# EAGLE design Testing FixtureForAICarBoard (EAGLE 9.6.2)
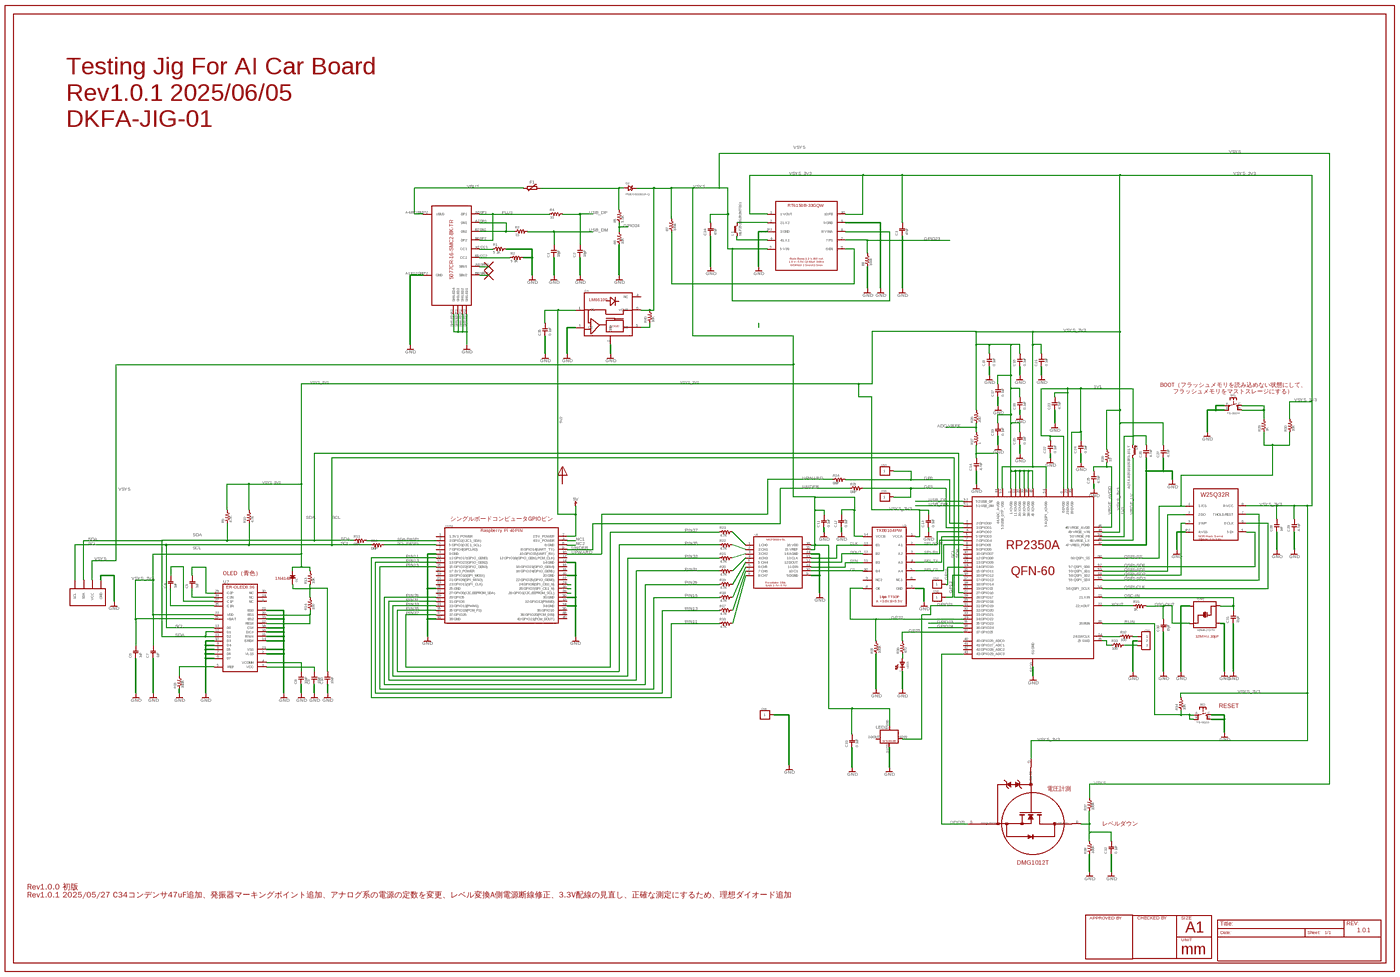
[diagram p0: schematic, sheet 1, overview]
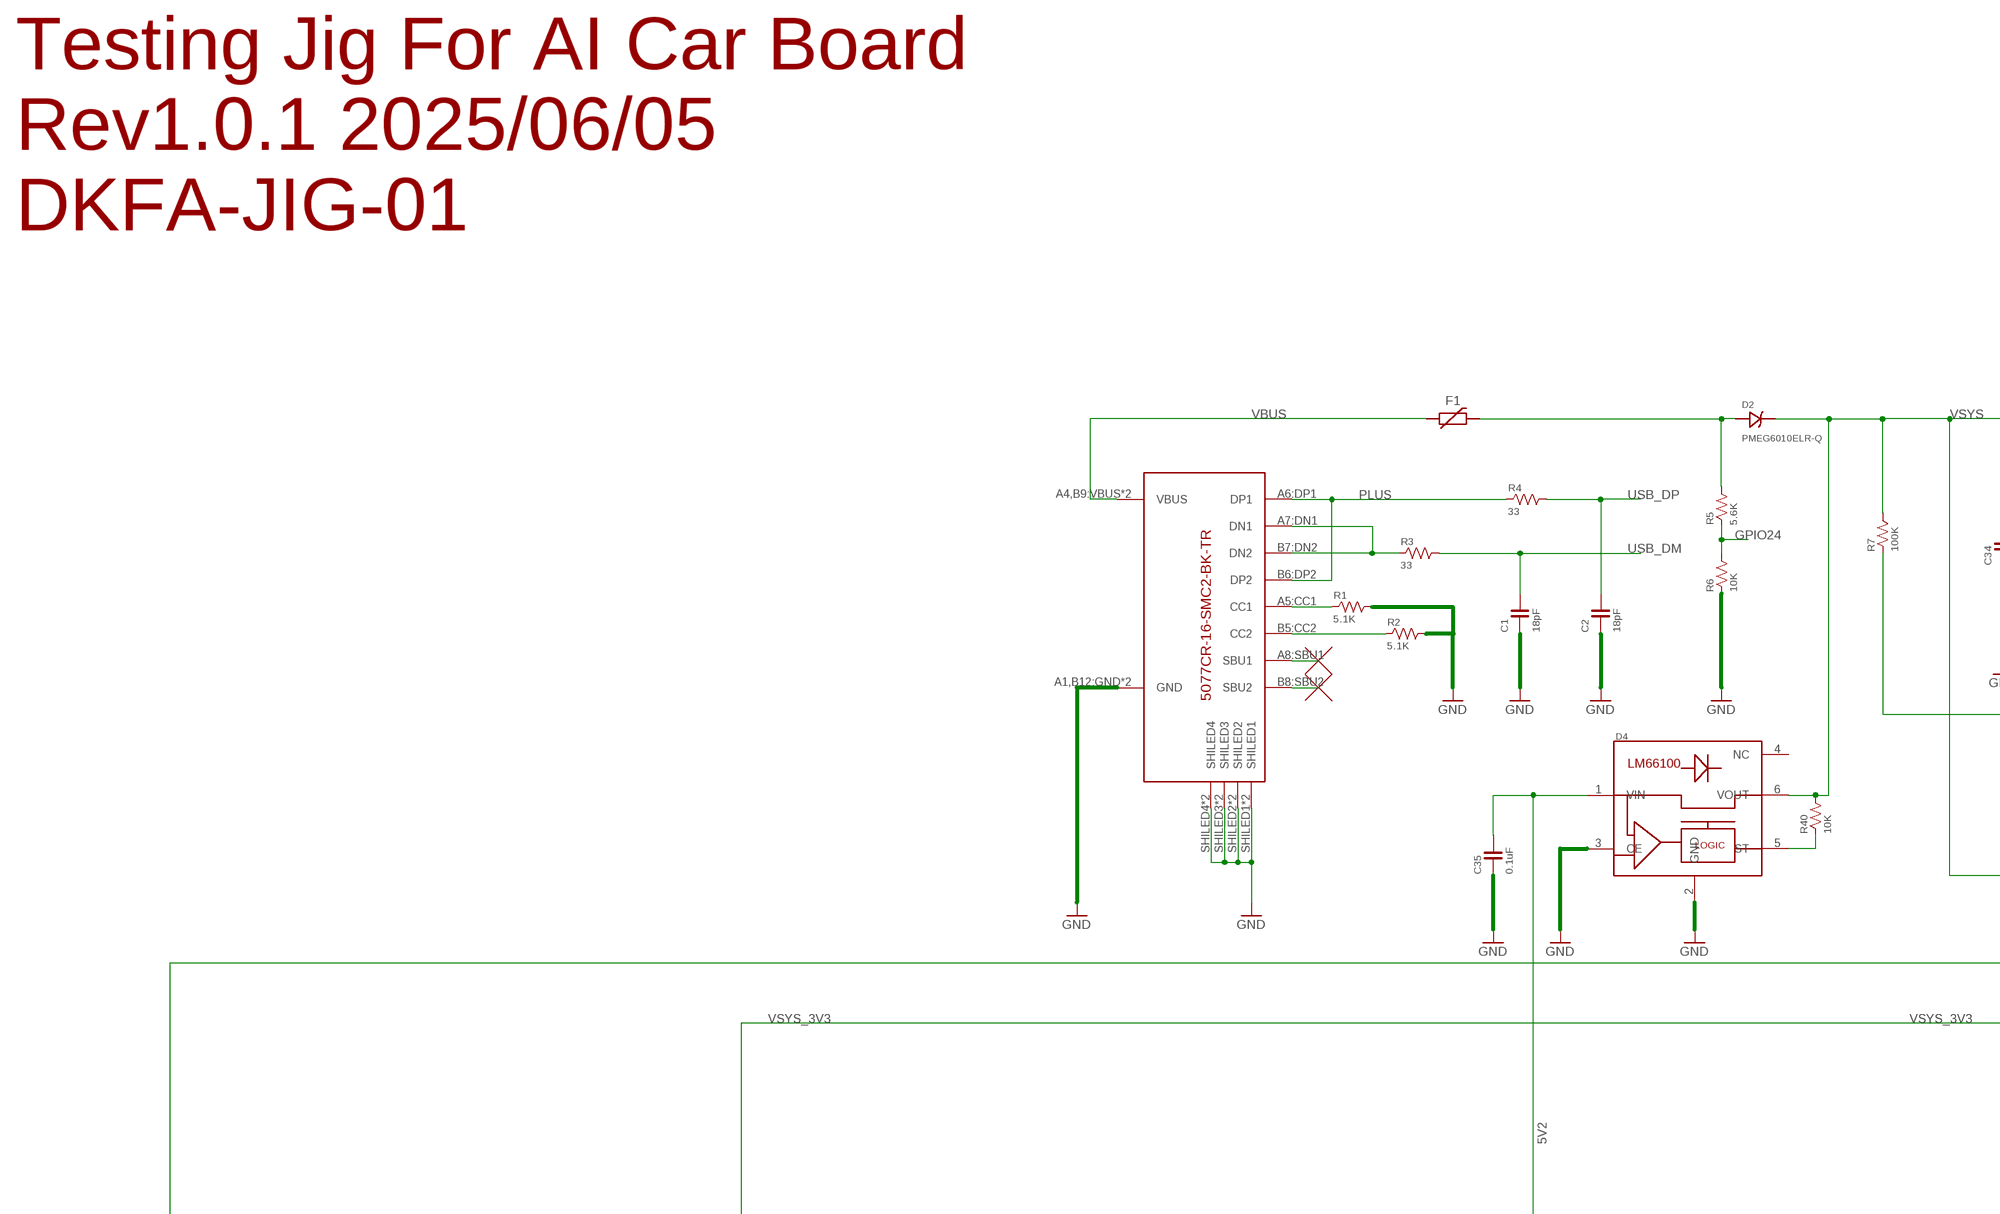
[diagram p1: schematic, sheet 1, part 1 of 4]
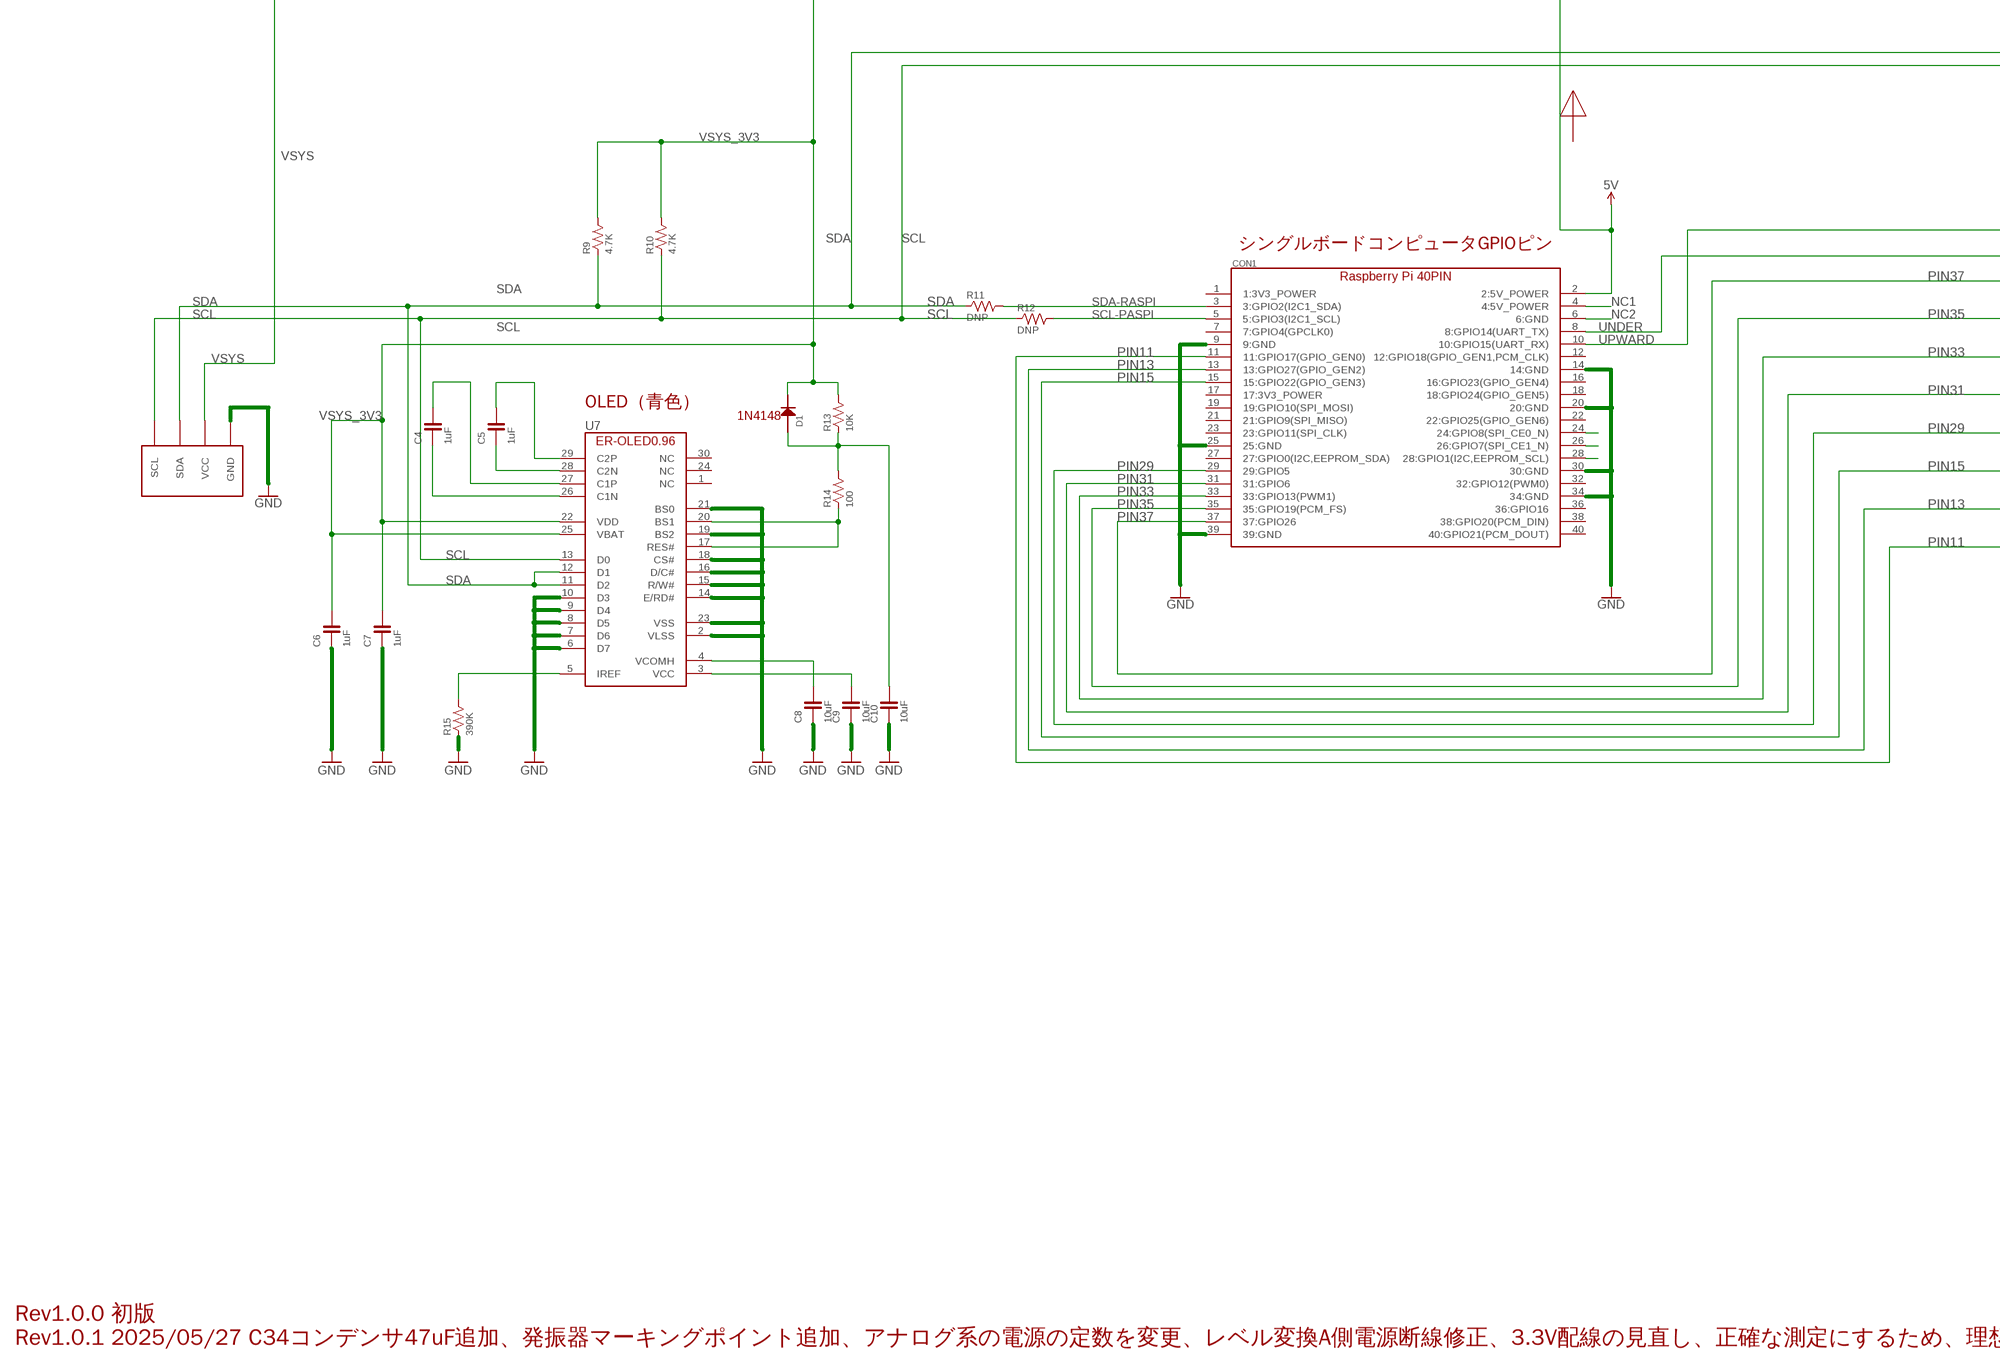
[diagram p2: schematic, sheet 1, part 2 of 4]
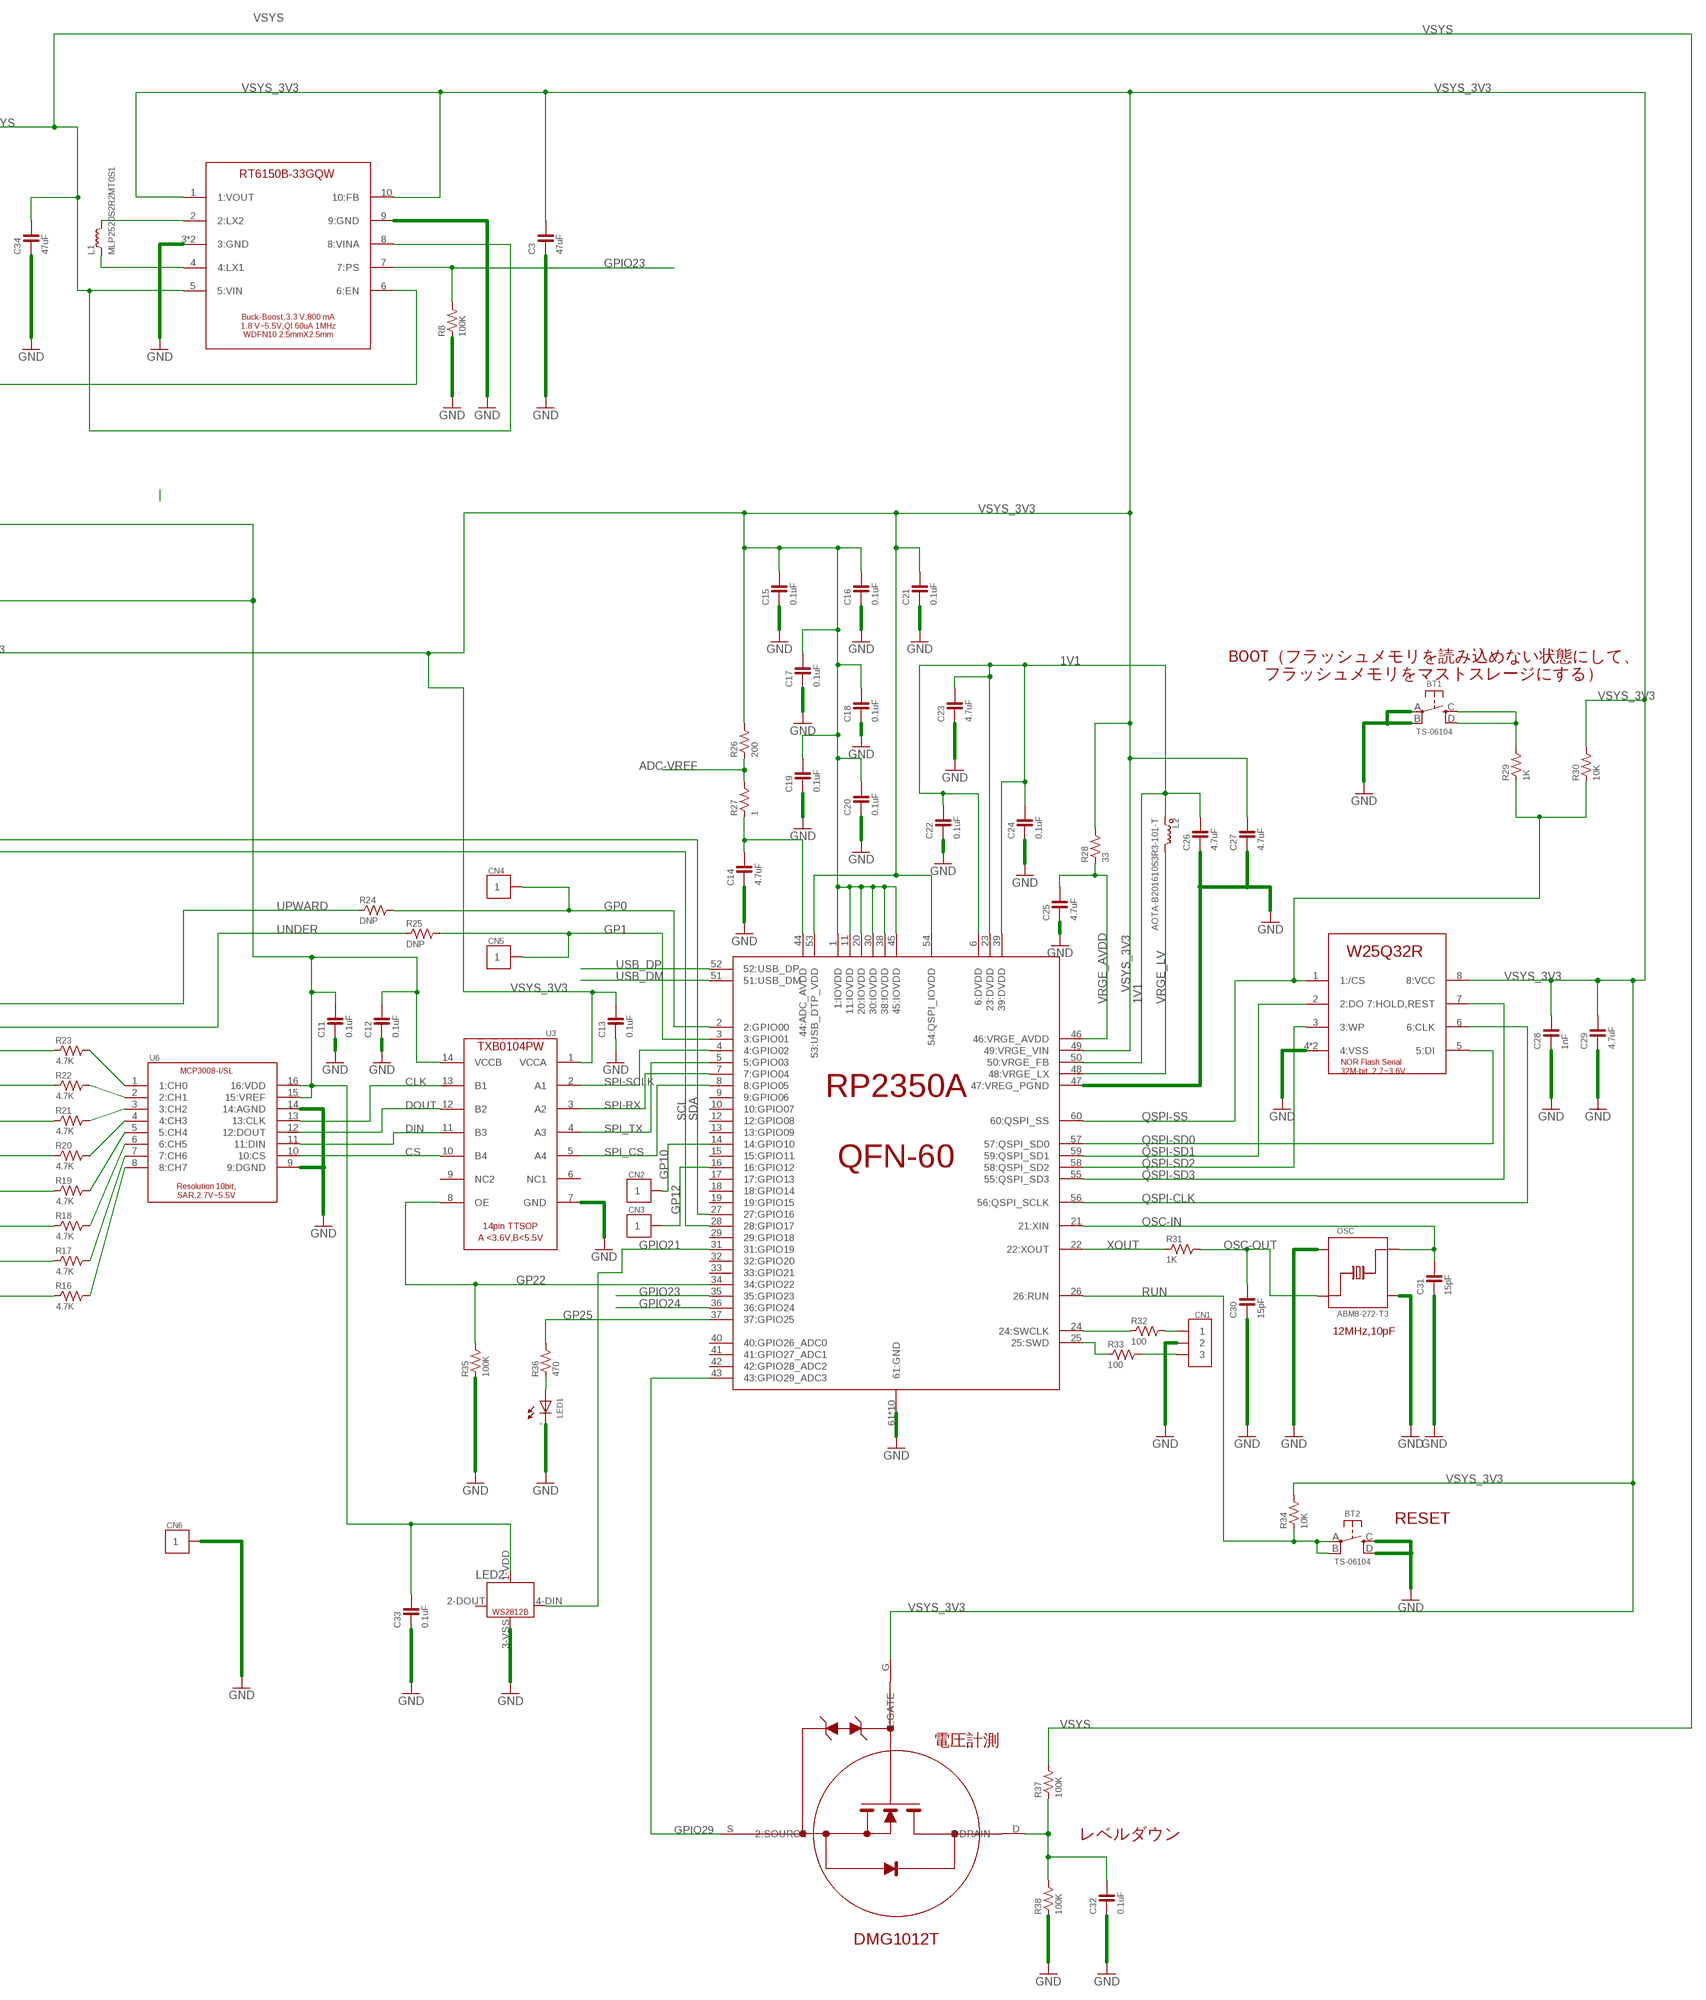
[diagram p3: schematic, sheet 1, part 3 of 4]
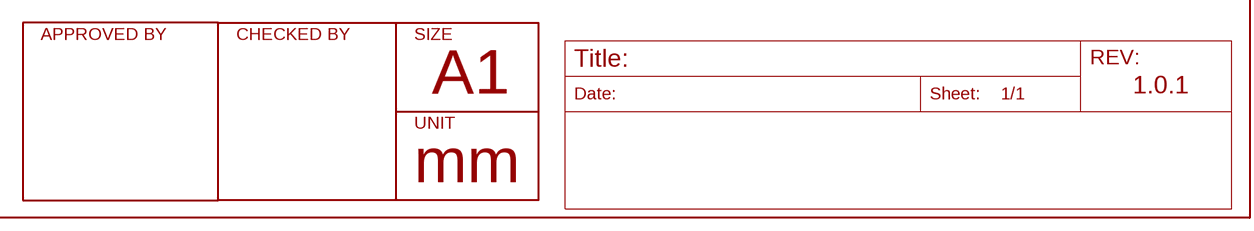
[diagram p4: schematic, sheet 1, part 4 of 4]

## Parts
BT1  TS-06104  [TS-06104]
BT2  TS-06104  [TS-06104]
C1  18pF  CAPACITOR-0603-BOTTOM  [0603-BOTTOM]
C2  18pF  CAPACITOR-0603-BOTTOM  [0603-BOTTOM]
C3  47uF  CAPACITOR-0603-BOTTOM  [0603-BOTTOM]
C4  1uF  CAPACITOR-0603-BOTTOM  [0603-BOTTOM]
C5  1uF  CAPACITOR-0603-BOTTOM  [0603-BOTTOM]
C6  1uF  CAPACITOR-0603-BOTTOM  [0603-BOTTOM]
C7  1uF  CAPACITOR-0603-BOTTOM  [0603-BOTTOM]
C8  10uF  CAPACITOR-0603-BOTTOM  [0603-BOTTOM]
C9  10uF  CAPACITOR-0603-BOTTOM  [0603-BOTTOM]
C10  10uF  CAPACITOR-0603-BOTTOM  [0603-BOTTOM]
C11  0.1uF  CAPACITOR-0603-BOTTOM  [0603-BOTTOM]
C12  0.1uF  CAPACITOR-0603-BOTTOM  [0603-BOTTOM]
C13  0.1uF  CAPACITOR-0603-BOTTOM  [0603-BOTTOM]
C14  4.7uF  CAPACITOR-0603-BOTTOM  [0603-BOTTOM]
C15  0.1uF  CAPACITOR-0603-BOTTOM  [0603-BOTTOM]
C16  0.1uF  CAPACITOR-0603-BOTTOM  [0603-BOTTOM]
C17  0.1uF  CAPACITOR-0603-BOTTOM  [0603-BOTTOM]
C18  0.1uF  CAPACITOR-0603-BOTTOM  [0603-BOTTOM]
C19  0.1uF  CAPACITOR-0603-BOTTOM  [0603-BOTTOM]
C20  0.1uF  CAPACITOR-0603-BOTTOM  [0603-BOTTOM]
C21  0.1uF  CAPACITOR-0603-BOTTOM  [0603-BOTTOM]
C22  0.1uF  CAPACITOR-0603-BOTTOM  [0603-BOTTOM]
C23  4.7uF  CAPACITOR-0603-BOTTOM  [0603-BOTTOM]
C24  0.1uF  CAPACITOR-0603-BOTTOM  [0603-BOTTOM]
C25  4.7uF  CAPACITOR-0603-BOTTOM  [0603-BOTTOM]
C26  4.7uF  CAPACITOR-0603-BOTTOM  [0603-BOTTOM]
C27  4.7uF  CAPACITOR-0603-BOTTOM  [0603-BOTTOM]
C28  1nF  CAPACITOR-0603-BOTTOM  [0603-BOTTOM]
C29  4.7uF  CAPACITOR-0603-BOTTOM  [0603-BOTTOM]
C30  15pF  CAPACITOR-0603-BOTTOM  [0603-BOTTOM]
C31  15pF  CAPACITOR-0603-BOTTOM  [0603-BOTTOM]
C32  0.1uF  CAPACITOR-0603-BOTTOM  [0603-BOTTOM]
C33  0.1uF  CAPACITOR-0603-BOTTOM  [0603-BOTTOM]
C34  47uF  CAPACITOR-0603-BOTTOM  [0603-BOTTOM]
C35  0.1uF  CAPACITOR-0603-BOTTOM  [0603-BOTTOM]
CN1  PIN_1X3  [PIN_1X3]
CN2  PIN_1X1-SMALL  [PIN_1X1_SMALL]
CN3  PIN_1X1-SMALL  [PIN_1X1_SMALL]
CN4  PIN_1X1-SMALL  [PIN_1X1_SMALL]
CN5  PIN_1X1-SMALL  [PIN_1X1_SMALL]
CN6  PIN_1X1-SMALL  [PIN_1X1_SMALL]
CON1  RASPBERRYPI_SHEILD  [RASPBERRY_PI_SHILED]
CON2  5077CR-16-SMC2-BK-TR  [5077CR-16-SMC2-BK-TR]
CON3  FABO_BRICK_I2C-S04B-PASK-2  [FABO_BRICK_I2C_S04B-PASK-2]
D1  1N4148  [1N4148W]
D2  PMEG6010ELR-Q  [SOD123W]
D4  LM66100  [SC-70]
F1  POLYSWITCH1206  [1206]
L1  MLP2520S2R2MT0S1  [1008(2520MM)]
L2  AOTA-B201610S3R3-101-T  [0806(2016MM)]
LED1  LED-0603  [0603]
LED2  WS2812B_NARROW  [WS2812B_NARROW]
OSC  ABM8-272-T3  [ABM8-272-T3]
R1  5.1K  RESISTOR-0603-BOTTOM  [0603-BOTTOM]
R2  5.1K  RESISTOR-0603-BOTTOM  [0603-BOTTOM]
R3  33  RESISTOR-0603-BOTTOM  [0603-BOTTOM]
R4  33  RESISTOR-0603-BOTTOM  [0603-BOTTOM]
R5  5.6K  RESISTOR-0603  [0603]
R6  10K  RESISTOR-0603  [0603]
R7  100K  RESISTOR-0603-BOTTOM  [0603-BOTTOM]
R8  100K  RESISTOR-0603-BOTTOM  [0603-BOTTOM]
R9  4.7K  RESISTOR-0603-BOTTOM  [0603-BOTTOM]
R10  4.7K  RESISTOR-0603-BOTTOM  [0603-BOTTOM]
R11  DNP  RESISTOR-0603-BOTTOM  [0603-BOTTOM]
R12  DNP  RESISTOR-0603-BOTTOM  [0603-BOTTOM]
R13  10K  RESISTOR-0603-BOTTOM  [0603-BOTTOM]
R14  100  RESISTOR-0603-BOTTOM  [0603-BOTTOM]
R15  390K  RESISTOR-0603-BOTTOM  [0603-BOTTOM]
R16  4.7K  RESISTOR-0603-BOTTOM  [0603-BOTTOM]
R17  4.7K  RESISTOR-0603-BOTTOM  [0603-BOTTOM]
R18  4.7K  RESISTOR-0603-BOTTOM  [0603-BOTTOM]
R19  4.7K  RESISTOR-0603-BOTTOM  [0603-BOTTOM]
R20  4.7K  RESISTOR-0603-BOTTOM  [0603-BOTTOM]
R21  4.7K  RESISTOR-0603-BOTTOM  [0603-BOTTOM]
R22  4.7K  RESISTOR-0603-BOTTOM  [0603-BOTTOM]
R23  4.7K  RESISTOR-0603-BOTTOM  [0603-BOTTOM]
R24  DNP  RESISTOR-0603-BOTTOM  [0603-BOTTOM]
R25  DNP  RESISTOR-0603-BOTTOM  [0603-BOTTOM]
R26  200  RESISTOR-0603-BOTTOM  [0603-BOTTOM]
R27  1  RESISTOR-0603-BOTTOM  [0603-BOTTOM]
R28  33  RESISTOR-0603-BOTTOM  [0603-BOTTOM]
R29  1K  RESISTOR-0603-BOTTOM  [0603-BOTTOM]
R30  10K  RESISTOR-0603-BOTTOM  [0603-BOTTOM]
R31  1K  RESISTOR-0603-BOTTOM  [0603-BOTTOM]
R32  100  RESISTOR-0603-BOTTOM  [0603-BOTTOM]
R33  100  RESISTOR-0603-BOTTOM  [0603-BOTTOM]
R34  10K  RESISTOR-0603-BOTTOM  [0603-BOTTOM]
R35  100K  RESISTOR-0603-BOTTOM  [0603-BOTTOM]
R36  470  RESISTOR-0603-BOTTOM  [0603-BOTTOM]
R37  100K  RESISTOR-0603  [0603]
R38  100K  RESISTOR-0603  [0603]
R40  10K  RESISTOR-0603  [0603]
U1  RP2350A  [QFN60]
U2  W25Q32RVXHJQ  [XSON8]
U3  TXB0104  [TSSOP-14]
U4  RT6150B-33GQW  [WDFN-10L_2.5X2.5MM]
U5  DMG1012T  [SOT-523]
U6  MCP3008  [SOIC-16]
U7  ER-OLED0.96-1ER-CON30HT-1_REV2  [ER-CON30HT-1_REV2]

## Nets
1V1: C22.2 C23.2 C24.2 C26.2 L2.2 U1.6(6:DVDD) U1.23(23:DVDD) U1.39(39:DVDD) U1.50(50:VRGE_FB)
5V2: C35.2 CON1.2(2:5V_POWER) D4.1(VIN) ; supply symbol labelled 5V
ADC-VREF: R26.1 R27.2
CLK: U3.13(B1) U6.13(13:CLK)
CS: U3.10(B4) U6.10(10:CS)
DATA: CN1.3 R33.2
DIN: U3.11(B3) U6.11(11:DIN)
DOUT: U3.12(B2) U6.12(12:DOUT)
GND: BT1.A BT1.B BT2.C BT2.D C1.1 C2.1 C3.1 C6.1 C7.1 C8.1 C9.1 C10.1 C11.1 C12.1 C13.1 C14.1 C15.1 C16.1 C17.1 C18.1 C19.1 C20.1 C21.1 C22.1 C23.1 C24.1 C25.1 C26.1 C27.1 C28.1 C29.1 C30.1 C31.1 C32.1 C33.1 C34.1 C35.1 CN1.2 CN6.1 CON1.9(9:GND) CON1.14(14:GND) CON1.20(20:GND) CON1.25(25:GND) CON1.30(30:GND) CON1.34(34:GND) CON1.39(39:GND) CON2.A1,B12:GND(GND) CON2.B1,A12:GND(GND) CON2.SHILED1 CON2.SHILED2 CON2.SHILED3 CON2.SHILED4 CON2.SHILED5(SHILED1) CON2.SHILED6(SHILED2) CON2.SHILED7(SHILED3) CON2.SHILED8(SHILED4) CON3.GND D4.2(GND) D4.3(CE) LED1.CATHODE LED2.3-VSS(VSS) OSC.2(#2) OSC.4(#4) R1.2 R2.2 R6.1 R8.1 R15.1 R35.1 R38.1 U1.47(47:VREG_PGND) U1.61(61:GND) U1.P$62(61:GND) U1.P$63(61:GND) U1.P$64(61:GND) U1.P$65(61:GND) U1.P$66(61:GND) U1.P$67(61:GND) U1.P$68(61:GND) U1.P$69(61:GND) U1.P$70(61:GND) U2.4(4:VSS) U2.9(4:VSS) U3.7(GND) U4.3(3:GND) U4.9(9:GND) U4.PAD(3:GND) U6.9(9:DGND) U6.14(14:AGND) U7.2(VLSS) U7.6(D7) U7.7(D6) U7.8(D5) U7.9(D4) U7.10(D3) U7.14(E/RD#) U7.15(R/W#) U7.16(D/C#) U7.18(CS#) U7.19(BS2) U7.21(BS0) U7.23(VSS)
GP0: CN4.1 R24.2 U1.2(2:GPIO00)
GP1: CN5.1 R25.2 U1.3(3:GPIO01)
GP10: CN2.1 U1.14(14:GPIO10)
GP12: CN3.1 U1.16(16:GPIO12)
GP22: R35.2 U1.34(34:GPIO22) U3.8(OE)
GP25: R36.2 U1.37(37:GPIO25)
GPIO21: LED2.4-DIN(DIN) U1.31(31:GPIO19)
GPIO23: R8.2 U1.35(35:GPIO23) U4.7(7:PS)
GPIO24: R5.1 R6.2 U1.36(36:GPIO24)
GPIO29: U1.43(43:GPIO29_ADC3) U5.S(2:SOURCE)
MINUS: CON2.A7:DN1(DN1) CON2.B7:DN2(DN2) R3.1
N$1: CON2.A5:CC1(CC1) R1.1
N$2: CON2.B5:CC2(CC2) R2.1
N$4: CON2.A8:SBU1(SBU1)
N$5: CON2.B8:SBU2(SBU2)
N$6: D4.5(ST) R40.1
N$7: C4.1 U7.26(C1N)
N$9: R23.2 U6.1(1:CH0)
N$10: L1.1 U4.4(4:LX1)
N$11: L1.2 U4.2(2:LX2)
N$12: R7.1 U4.6(6:EN)
N$13: R22.2 U6.2(2:CH1)
N$14: C4.2 U7.27(C1P)
N$16: R21.2 U6.3(3:CH2)
N$17: R20.2 U6.4(4:CH3)
N$18: R19.2 U6.5(5:CH4)
N$19: C5.1 U7.28(C2N)
N$20: R18.2 U6.6(6:CH5)
N$21: C5.2 U7.29(C2P)
N$22: R17.2 U6.7(7:CH6)
N$23: R15.2 U7.5(IREF)
N$24: C8.2 U7.4(VCOMH)
N$25: C9.2 U7.3(VCC)
N$26: R14.1 U7.17(RES#) U7.20(BS1)
N$27: C10.2 D1.ANODE R13.1 R14.2
N$28: R16.2 U6.8(8:CH7)
N$34: C14.2 R27.1 U1.44(44:ADC_AVDD)
N$39: C32.2 R37.1 R38.2 U5.D(3:DRAIN)
N$41: BT1.C BT1.D R29.2
N$44: LED1.ANODE R36.1
N$63: CON1.24(24:GPIO8(SPI_CE0_N))
N$65: CON1.26(26:GPIO7(SPI_CE1_N))
N$68: CON1.28(28:GPIO1(I2C,EEPROM_SCL))
NC1: CON1.4(4:5V_POWER)
NC2: CON1.6(6:GND)
OSC-IN: C31.2 OSC.3(#3) U1.21(21:XIN)
OSC-OUT: C30.2 OSC.1(#1) R31.2
PIN11: CON1.11(11:GPIO17(GPIO_GEN0)) R16.1
PIN13: CON1.13(13:GPIO27(GPIO_GEN2)) R17.1
PIN15: CON1.15(15:GPIO22(GPIO_GEN3)) R18.1
PIN29: CON1.29(29:GPIO5) R19.1
PIN31: CON1.31(31:GPIO6) R20.1
PIN33: CON1.33(33:GPIO13(PWM1)) R21.1
PIN35: CON1.35(35:GPIO19(PCM_FS)) R22.1
PIN37: CON1.37(37:GPIO26) R23.1
PLUS: CON2.A6:DP1(DP1) CON2.B6:DP2(DP2) R4.1
QSPI-CLK: U1.56(56:QSPI_SCLK) U2.6(6:CLK)
QSPI-SD0: U1.57(57:QSPI_SD0) U2.5(5:DI)
QSPI-SD1: U1.59(59:QSPI_SD1) U2.2(2:DO)
QSPI-SD2: U1.58(58:QSPI_SD2) U2.3(3:WP)
QSPI-SD3: U1.55(55:QSPI_SD3) U2.7(7:HOLD,REST)
QSPI-SS: R29.1 R30.1 U1.60(60:QSPI_SS) U2.1(1:/CS)
RUN: BT2.A BT2.B R34.1 U1.26(26:RUN)
SCL: CON3.SCL R10.1 R12.1 U1.28(28:GPIO17) U7.13(D0)
SCL-PASPI: CON1.5(5:GPIO3(I2C1_SCL)) R12.2
SDA: CON3.SDA R9.1 R11.1 U1.27(27:GPIO16) U7.11(D2) U7.12(D1)
SDA-RASPI: CON1.3(3:GPIO2(I2C1_SDA)) R11.2
SPI-RX: U1.7(7:GPIO04) U3.3(A2)
SPI-SCLK: U1.4(4:GPIO02) U3.2(A1)
SPI_CS: U1.8(8:GPIO05) U3.5(A4)
SPI_TX: U1.5(5:GPIO03) U3.4(A3)
SW_CLK: CN1.1 R32.2
SWCLK: R32.1 U1.24(24:SWCLK)
SWD: R33.1 U1.25(25:SWD)
UNDER: CON1.8(8:GPIO14(UART_TX)) R25.1
UPWARD: CON1.10(10:GPIO15(UART_RX)) R24.1
USB_DM: C1.2 R3.2 U1.51(51:USB_DM)
USB_DP: C2.2 R4.2 U1.52(52:USB_DP)
VBUS: CON2.A4,B9:VBUS(VBUS) CON2.B4,A9:VBUS(VBUS) F1.1
VBUS-2: D2.2(ANODE) F1.2 R5.2
VRGE_AVDD: C25.2 R28.1 U1.46(46:VRGE_AVDD)
VRGE_LV: L2.1 U1.48(48:VRGE_LX)
VSYS: C11.2 C12.2 C33.2 C34.2 CON3.VCC D2.1(CATHODE) D4.6(VOUT) LED2.1-VDD(VDD) R7.2 R37.2 R40.2 U3.14(VCCB) U4.5(5:VIN) U4.8(8:VINA) U6.15(15:VREF) U6.16(16:VDD)
VSYS_3V3: C3.2 C6.2 C7.2 C13.2 C15.2 C16.2 C17.2 C18.2 C19.2 C20.2 C21.2 C27.2 C28.2 C29.2 D1.CATHODE R9.2 R10.2 R13.2 R26.2 R28.2 R30.2 R34.2 U1.1(1:IOVDD) U1.11(11:IOVDD) U1.20(20:IOVDD) U1.30(30:IOVDD) U1.38(38:IOVDD) U1.45(45:IOVDD) U1.49(49:VRGE_VIN) U1.53(53:USB_DTP_VDD) U1.54(54:QSPI_IOVDD) U2.8(8:VCC) U3.1(VCCA) U4.1(1:VOUT) U4.10(10:FB) U5.G(1:GATE) U7.22(VDD) U7.25(VBAT)
XOUT: R31.1 U1.22(22:XOUT)
Unconnected: CON1.1(1:3V3_POWER) CON1.7(7:GPIO4(GPCLK0)) CON1.12(12:GPIO18(GPIO_GEN1,PCM_CLK)) CON1.16(16:GPIO23(GPIO_GEN4)) CON1.17(17:3V3_POWER) CON1.18(18:GPIO24(GPIO_GEN5)) CON1.19(19:GPIO10(SPI_MOSI)) CON1.21(21:GPIO9(SPI_MISO)) CON1.22(22:GPIO25(GPIO_GEN6)) CON1.23(23:GPIO11(SPI_CLK)) CON1.27(27:GPIO0(I2C,EEPROM_SDA)) CON1.32(32:GPIO12(PWM0)) CON1.36(36:GPIO16) CON1.38(38:GPIO20(PCM_DIN)) CON1.40(40:GPIO21(PCM_DOUT)) D4.4(NC) LED2.2-DOUT(DOUT) U1.9(9:GPIO06) U1.10(10:GPIO07) U1.12(12:GPIO08) U1.13(13:GPIO09) U1.15(15:GPIO11) U1.17(17:GPIO13) U1.18(18:GPIO14) U1.19(19:GPIO15) U1.29(29:GPIO18) U1.32(32:GPIO20) U1.33(33:GPIO21) U1.40(40:GPIO26_ADC0) U1.41(41:GPIO27_ADC1) U1.42(42:GPIO28_ADC2) U3.6(NC1) U3.9(NC2) U7.1(NC) U7.24(NC) U7.30(NC)

## Notes on the sheet
- Testing Jig For AI Car Board
  Rev1.0.1 2025/06/05
  DKFA-JIG-01
- LM66100
- BOOT（フラッシュメモリを読み込めない状態にして、
  フラッシュメモリをマストスレージにする）
- シングルボードコンピュータGPIOピン
- OLED（青色）
- 1N4148
- 12MHz,10pF
- RESET
- 電圧計測
- レベルダウン
- DMG1012T
- Rev1.0.0 初版
  Rev1.0.1 2025/05/27 C34コンデンサ47uF追加、発振器マーキングポイント追加、アナログ系の電源の定数を変更、レベル変換A側電源断線修正、3.3V配線の見直し、正確な測定にするため、理想ダイオード追加
- 1.0.1

## Library data of the parts
BT1 BT2 = FaBo-Switch:TS-06104
C1-C3 C11-C35 = FaBo-Capacitor:CAPACITOR: CAPACITOR; SPICEPREFIX: C
C4-C10 = FaBo-Capacitor:CAPACITOR: CAPACITOR
CN1 = FaBo-PIN:PIN_1X3
CN2-CN6 = FaBo-PIN:PIN_1X1
CON1 = FaBo-Boards:RASPBERRYPI_SHEILD
CON2 = FaBo-USB:5077CR-16-SMC2-BK-TR; SPICEPREFIX: X
CON3 = FaBo-Template:FABO_BRICK_I2C: FaBo Brick I2C
D1 = FaBo-Diode:1N4148
D2 = FaBo-Diode:PMEG6010ELR-Q
D4 = FaBo-Diode:LM66100
F1 = FaBo-Supply:POLYSWITCH
L1 = FaBo-Coil:MLP2520S2R2MT0S1
L2 = FaBo-Coil:AOTA-B201610S3R3-101-T
LED1 = FaBo-LED:LED
LED2 = FaBo-LED:WS2812B_NARROW
OSC = FaBo-Crystal:ABM8-272-T3
R1-R4 R7 R8 R11 R12 R16-R30 R34-R36 = FaBo-Resistors:RESISTOR: RESISTOR; SPICEPREFIX: R
R5 R6 R9 R10 R13-R15 R31-R33 R37 R38 R40 = FaBo-Resistors:RESISTOR: RESISTOR
U1 = FaBo-MPU:RP2350A
U2 = FaBo-NORFLASH:W25Q32RVXHJQ
U3 = FaBo-LevelTranslator:TXB0104
U4 = FaBo-Supply:RT6150B-33GQW
U5 = FaBo-Mosfet:DMG1012T
U6 = FaBo-ADC:MCP3008
U7 = FaBo-Display:ER-OLED0.96-1: ER-CON30HT-1 Rev2 wide distance 0.23mm

## Board
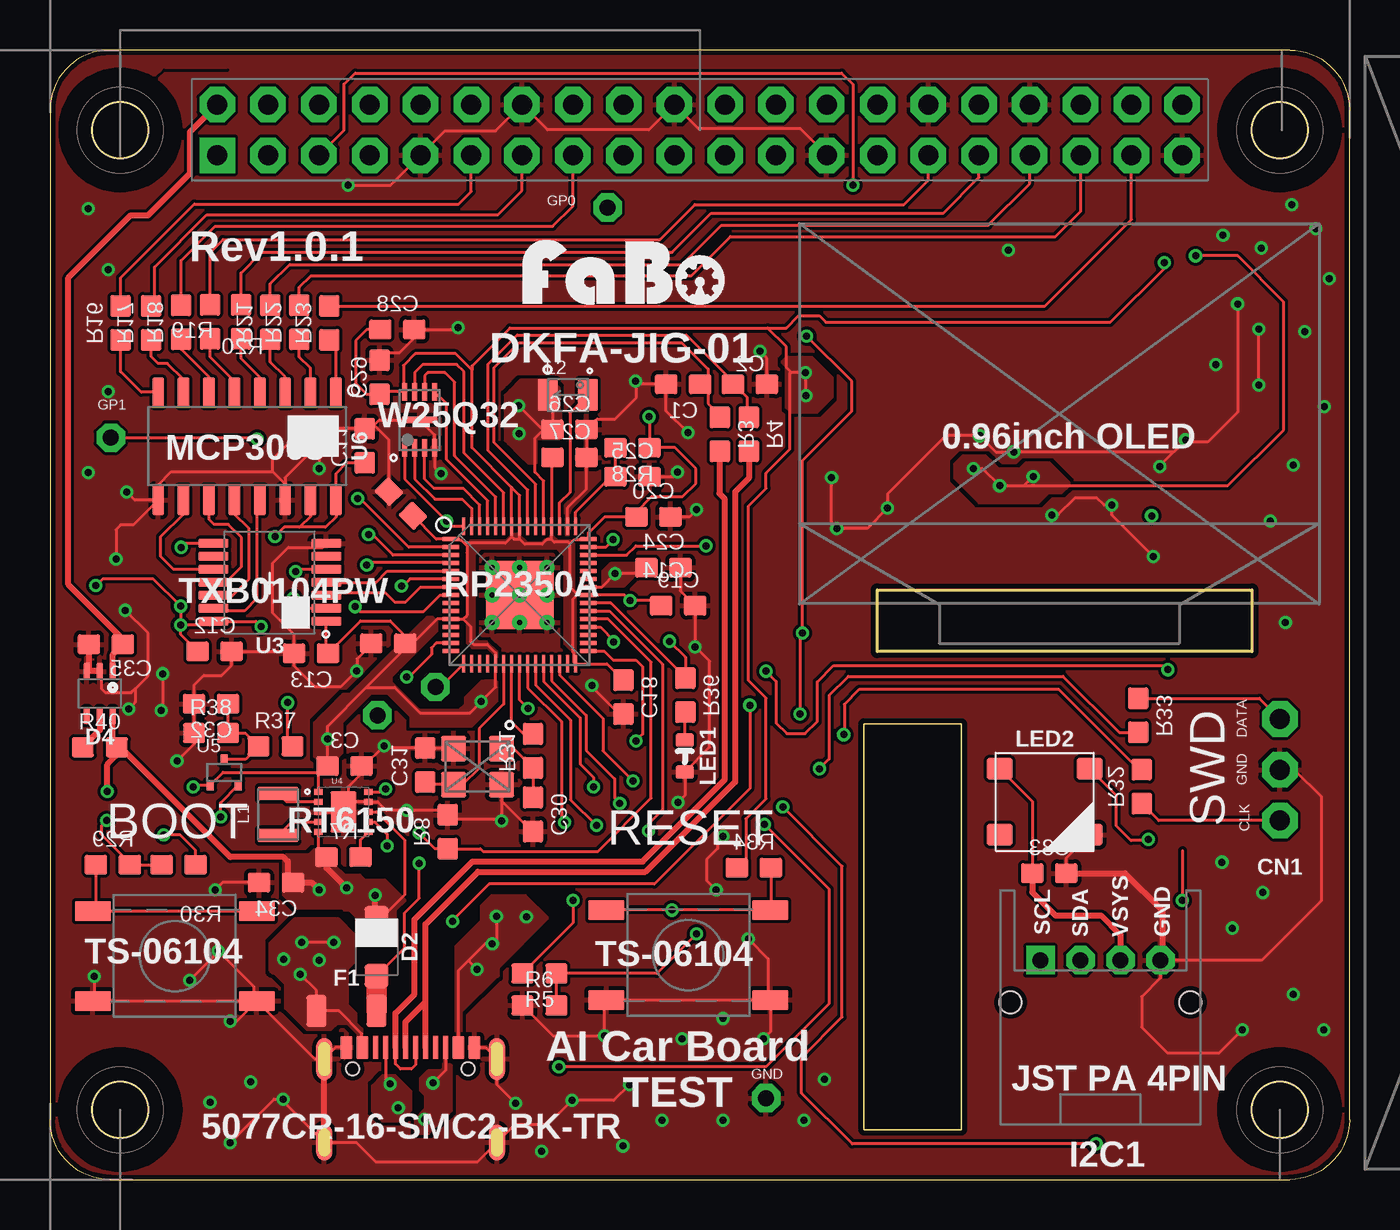
[diagram p5: board, top side]
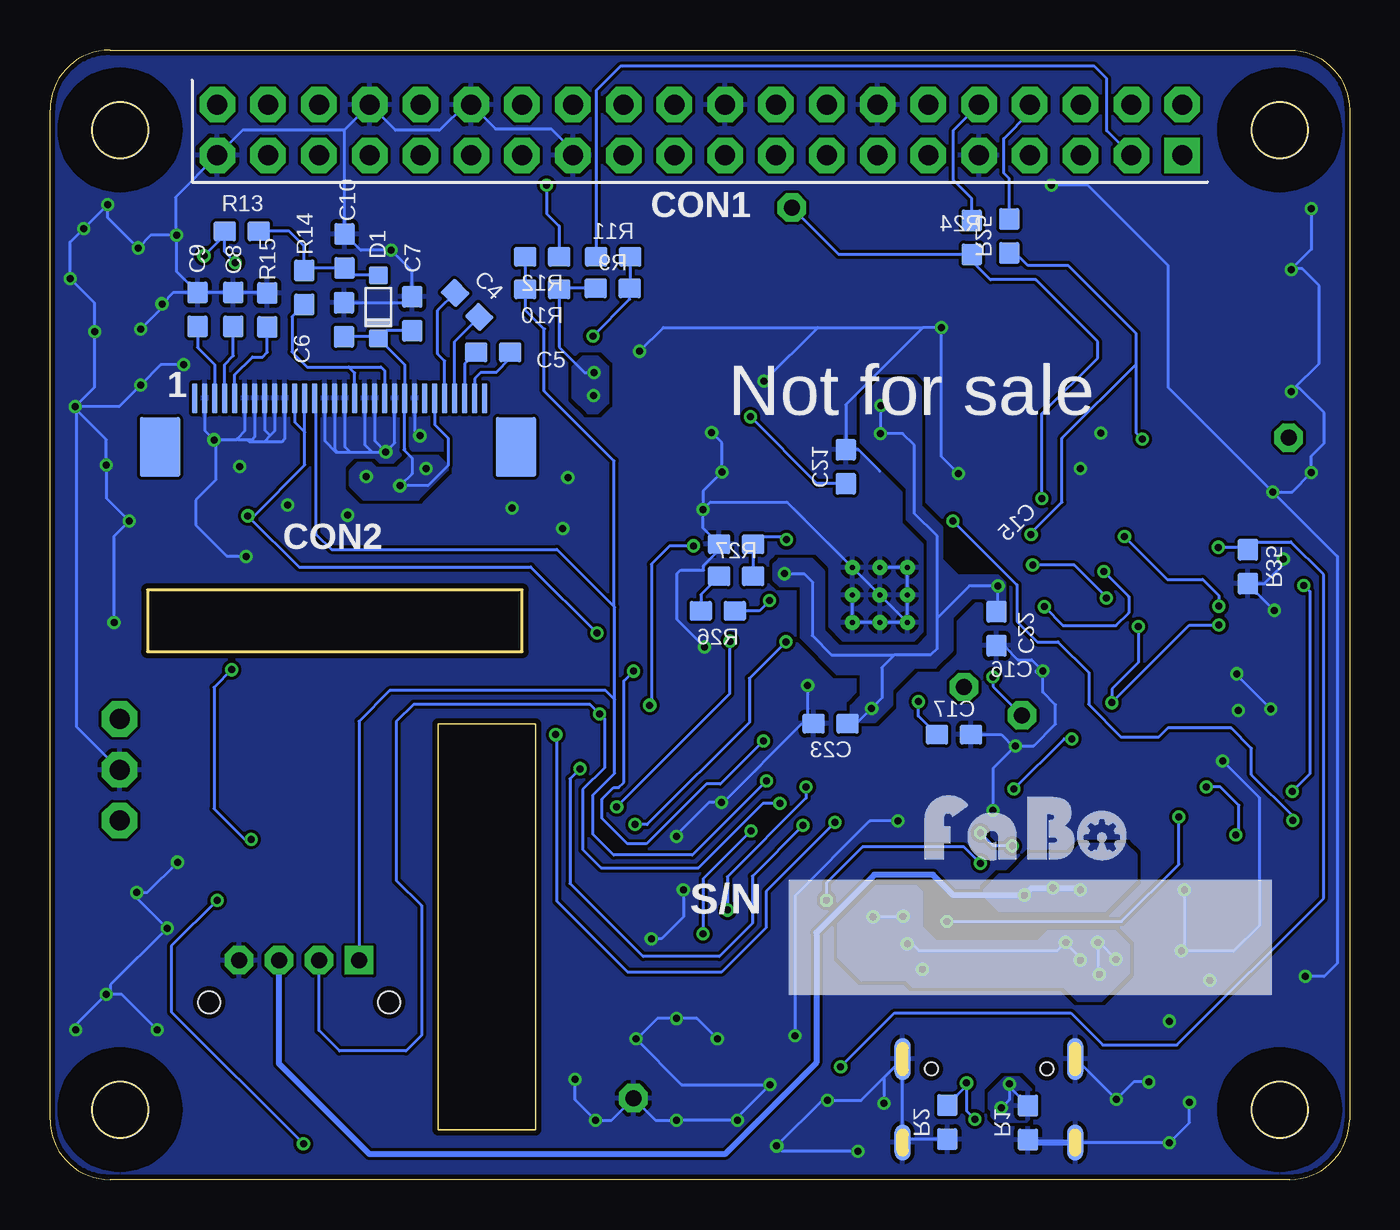
[diagram p6: board, bottom side, seen from below]

Size 65 x 56.5 mm. Coordinates in mm from the lower left corner, seen from the top.
Outline: 41.38,29.5 60.12,29.5 60.12,26.41 41.38,26.41 41.38,29.5
Outline: 40.71,22.8 45.59,22.8 45.59,2.5 40.71,2.5 40.71,22.8
Copper layers (1*16): Top 0.035mm / dielectric 1.6mm / Bottom 0.035mm
Design rules "PCBway": minimum track width 6mil, minimum drill 12mil, track to track 6mil, track to pad 6mil, pad to pad 6mil, via to via 6mil, smd to smd 6mil, copper to edge 10mil, drill to drill 10mil, minimum pad ring 10mil, minimum via ring 6mil, stop-mask expansion 2mil, vias tented up to drill 100mil, thermal gap 8mil
Holes 2.8 mm at 3.5,52.5 61.5,52.5 3.5,3.5 61.5,3.5
tRestrict: area 0.5,49.4 to 6.6,55.6; area 58.4,49.4 to 64.6,55.6; area 0.4,0.4 to 6.6,6.6; area 58.4,0.4 to 64.6,6.6; 2 lines
bRestrict: area 0.4,49.4 to 6.6,55.6; area 58.4,49.4 to 64.6,55.6; area 0.4,0.4 to 6.6,6.6; area 58.4,0.4 to 64.6,6.6; 8 lines

### Footprints (pad centres in the part's own frame; a part is rotated, then mirrored left to right if it is on the bottom)
TS-06104 = smd 1.8 x 1: A 4.1,2.25; B -4.1,2.25; C 4.1,-2.25; D -4.1,-2.25
0603-BOTTOM = smd 1.1 x 1 bottom: 1 -0.85,0; 2 0.85,0
PIN_1X3 = drill 1 pad 1.778 octagon: 1 -2.54,0; 2 0,0; 3 2.54,0
PIN_1X1_SMALL = drill 0.8 pad 1.422 octagon: 1 0,0
RASPBERRY_PI_SHILED = drill 1 pad 1.778 square: 1 -24.13,-1.27 | drill 1 pad 1.778 octagon: 2 -24.13,1.27; 3 -21.59,-1.27; 4 -21.59,1.27; 5 -19.05,-1.27; 6 -19.05,1.27; 7 -16.51,-1.27; 8 -16.51,1.27; 9 -13.97,-1.27; 10 -13.97,1.27; 11 -11.43,-1.27; 12 -11.43,1.27; 13 -8.89,-1.27; 14 -8.89,1.27; 15 -6.35,-1.27; 16 -6.35,1.27; 17 -3.81,-1.27; 18 -3.81,1.27; 19 -1.27,-1.27; 20 -1.27,1.27; 21 1.27,-1.27; 22 1.27,1.27; 23 3.81,-1.27; 24 3.81,1.27; 25 6.35,-1.27; 26 6.35,1.27; 27 8.89,-1.27; 28 8.89,1.27; 29 11.43,-1.27; 30 11.43,1.27; 31 13.97,-1.27; 32 13.97,1.27; 33 16.51,-1.27; 34 16.51,1.27; 35 19.05,-1.27; 36 19.05,1.27; 37 21.59,-1.27; 38 21.59,1.27; 39 24.13,-1.27; 40 24.13,1.27
5077CR-16-SMC2-BK-TR = smd 0.6 x 1.14: A1,B12:GND -3.2,0; A4,B9:VBUS -2.4,0; B1,A12:GND 3.2,0; B4,A9:VBUS 2.4,0 | smd 0.3 x 1.14: A5:CC1 -1.25,0; A6:DP1 -0.25,0; A7:DN1 0.25,0; A8:SBU1 1.25,0; B5:CC2 1.75,0; B6:DP2 0.75,0; B7:DN2 -0.75,0; B8:SBU2 -1.75,0 | smd 0.8 x 2.1: SHILED1 -4.32,-0.57; SHILED2 4.32,-0.57 | smd 0.8 x 1.8: SHILED3 -4.32,-4.75; SHILED4 4.32,-4.75 | smd 0.8 x 2.1 bottom: SHILED5 -4.32,-0.57; SHILED7 4.32,-0.57 | smd 0.8 x 1.8 bottom: SHILED6 -4.32,-4.75; SHILED8 4.32,-4.75 | hole 0.65: -2.89,-1.07; 2.89,-1.07
FABO_BRICK_I2C_S04B-PASK-2 = drill 0.8 pad 1.422 octagon: GND -3,0; SDA 1,0; VCC -1,0 | drill 0.8 pad 1.422 square: SCL 3,0 | hole 1.1: 4.5,2.1; -4.5,2.1
1N4148W = smd 0.9 x 0.95: ANODE 0,0; CATHODE 3.15,0
SOD123W = smd 1.2 x 1.2: 1 -1.45,0; 2 1.45,0
SC-70 = smd 0.35 x 0.85: 1 -0.65,-1.1; 2 0,-1.1; 3 0.65,-1.1; 4 0.65,1.1; 5 0,1.1; 6 -0.65,1.1
1206 = smd 1 x 1.6: 1 -1.5,0; 2 1.5,0
1008(2520MM) = smd 0.7 x 2: 1 -1.05,0; 2 1.05,0
0806(2016MM) = smd 1 x 1.6: 1 1,0; 2 -1,0
0603 = smd 0.65 x 0.9: ANODE -0.8,0; CATHODE 0.8,0
WS2812B_NARROW = smd 1.3 x 1.1: 1-VDD -2.25,1.65; 2-DOUT -2.25,-1.65; 3-VSS 2.25,-1.65; 4-DIN 2.25,1.65
ABM8-272-T3 = smd 1.27 x 1.27: 1 -1.2,-0.9; 2 1.2,-0.9; 3 1.2,0.9; 4 -1.2,0.9
0603' = smd 1.1 x 1: 1 -0.85,0; 2 0.85,0
QFN60 = smd 0.875 x 0.2: 1 -3.438,2.8; 2 -3.438,2.4; 3 -3.438,2; 4 -3.438,1.6; 5 -3.438,1.2; 6 -3.438,0.8; 7 -3.438,0.4; 8 -3.438,0; 9 -3.438,-0.4; 10 -3.438,-0.8; 11 -3.438,-1.2; 12 -3.438,-1.6; 13 -3.438,-2; 14 -3.438,-2.4; 15 -3.438,-2.8; 31 3.438,-2.8; 32 3.438,-2.4; 33 3.438,-2; 34 3.438,-1.6; 35 3.438,-1.2; 36 3.438,-0.8; 37 3.438,-0.4; 38 3.438,0; 39 3.438,0.4; 40 3.438,0.8; 41 3.438,1.2; 42 3.438,1.6; 43 3.438,2; 44 3.438,2.4; 45 3.438,2.8 | smd 0.2 x 0.875: 16 -2.8,-3.438; 17 -2.4,-3.438; 18 -2,-3.438; 19 -1.6,-3.438; 20 -1.2,-3.438; 21 -0.8,-3.438; 22 -0.4,-3.438; 23 0,-3.438; 24 0.4,-3.438; 25 0.8,-3.438; 26 1.2,-3.438; 27 1.6,-3.438; 28 2,-3.438; 29 2.4,-3.438; 30 2.8,-3.438; 46 2.8,3.438; 47 2.4,3.438; 48 2,3.438; 49 1.6,3.438; 50 1.2,3.438; 51 0.8,3.438; 52 0.4,3.438; 53 0,3.438; 54 -0.4,3.438; 55 -0.8,3.438; 56 -1.2,3.438; 57 -1.6,3.438; 58 -2,3.438; 59 -2.4,3.438; 60 -2.8,3.438 | smd 3.4 x 3.4: 61 0,0 | drill 0.25 pad 0.61: P$62 0,0; P$63 -1.375,0; P$64 0,-1.375; P$65 -1.375,-1.375; P$66 1.375,-1.375; P$67 1.375,0; P$68 -1.375,1.375; P$69 0,1.375; P$70 1.375,1.375
XSON8 = smd 0.85 x 0.3: 1 -1.4,0.75; 2 -1.4,0.25; 3 -1.4,-0.25; 4 -1.4,-0.75; 5 1.4,-0.75; 6 1.4,-0.25; 7 1.4,0.25; 8 1.4,0.75 | smd 0.3 x 1.78: 9 0,0
TSSOP-14 = smd 0.45 x 1.5: 1 -1.95,-2.825; 2 -1.3,-2.825; 3 -0.65,-2.825; 4 0,-2.825; 5 0.65,-2.825; 6 1.3,-2.825; 7 1.95,-2.825; 8 1.95,2.825; 9 1.3,2.825; 10 0.65,2.825; 11 0,2.825; 12 -0.65,2.825; 13 -1.3,2.825; 14 -1.95,2.825
WDFN-10L_2.5X2.5MM = smd 0.3 x 0.45: 1 -1,-1.25; 2 -0.5,-1.25; 3 0,-1.25; 4 0.5,-1.25; 5 1,-1.25; 6 1,1.25; 7 0.5,1.25; 8 0,1.25; 9 -0.5,1.25; 10 -1,1.25 | smd 2.07 x 1.3: PAD 0,0
SOT-523 = smd 0.4 x 0.51: D 0,0.645; G -0.7,-0.645; S 0.7,-0.645
SOIC-16 = smd 0.6 x 1.5: 1 -4.445,-2.7; 2 -3.175,-2.7; 3 -1.905,-2.7; 4 -0.635,-2.7; 5 0.635,-2.7; 6 1.905,-2.7; 7 3.175,-2.7; 8 4.445,-2.7; 9 4.445,2.7; 10 3.175,2.7; 11 1.905,2.7; 12 0.635,2.7; 13 -0.635,2.7; 14 -1.905,2.7; 15 -3.175,2.7; 16 -4.445,2.7
ER-CON30HT-1_REV2 = smd 0.27 x 1.5 bottom: 1 7,-0.23; 2 6.5,-0.23; 3 6,-0.23; 4 5.5,-0.23; 5 5,-0.23; 6 4.5,-0.23; 7 4,-0.23; 8 3.5,-0.23; 9 3,-0.23; 10 2.5,-0.23; 11 2,-0.23; 12 1.5,-0.23; 13 1,-0.23; 14 0.5,-0.23; 15 0,-0.23; 16 -0.5,-0.23; 17 -1,-0.23; 18 -1.5,-0.23; 19 -2,-0.23; 20 -2.5,-0.23; 21 -3,-0.23; 22 -3.5,-0.23; 23 -4,-0.23; 24 -4.5,-0.23; 25 -5,-0.23; 26 -5.5,-0.23; 27 -6,-0.23; 28 -6.5,-0.23; 29 -7,-0.23; 30 -7.5,-0.23 | smd 2 x 3 bottom: 31 -9.07,-2.67; 32 8.74,-2.67

### Placement (x,y rotation side)
BT1  6.25,11.18 180 top
BT2  31.93,11.23 0 top
C1  31.67,39.78 180 bottom
C2  35,39.78 0 bottom
C3  14.73,20.68 0 bottom
C4  44.14,43.75 225 top
C5  42.83,41.38 180 top
C6  50.29,43.01 270 top
C7  46.88,43.31 270 top
C8  55.83,43.52 270 top
C9  57.62,43.52 270 top
C10  50.27,46.44 270 top
C11  15.75,36.7 270 bottom
C12  8.23,26.42 0 bottom
C13  13.06,26.31 180 bottom
C14  30.68,31.78 180 top
C15  17.55,33.81 225 bottom
C16  16.92,26.82 180 bottom
C17  19.79,22.25 0 top
C18  28.68,24.13 90 bottom
C19  31.42,28.7 0 bottom
C20  30.18,33.15 0 bottom
C21  25.2,35.66 270 top
C22  17.65,27.56 90 top
C23  25.96,22.81 180 top
C24  30.68,30.61 0 bottom
C25  29.13,35.15 0 bottom
C26  25.98,37.52 0 bottom
C27  25.98,36.12 0 bottom
C28  17.37,42.52 0 bottom
C29  16.48,40.13 270 bottom
C30  24.16,18.26 90 bottom
C31  18.77,20.73 270 bottom
C32  8.05,23.8 180 bottom
C33  49.99,15.32 0 bottom
C34  11.3,14.86 180 bottom
C35  2.79,26.77 180 bottom
CN1  61.52,20.5 90 top
CN2  16.38,23.22 0 top
CN3  19.28,24.64 0 top
CN4  27.89,48.62 0 top
CN5  3.05,37.11 0 top
CN6  35.81,4.06 0 top
CON1  32.5,52.5 0 top
CON2  18.03,6.6 0 top
CON3  52.55,10.97 180 top
D1  48.58,45.23 270 bottom
D2  16.33,11.63 270 top
D4  2.49,24.31 180 top
F1  14.83,8.43 0 top
L1  11.4,18.26 90 top
L2  25.91,39.24 0 top
LED1  31.75,21.18 270 top
LED2  49.76,18.9 0 top
LOGO1  [LOGO_FABO_M]  28.69,43.38 0 top
LOGO2  [LOGO_FABO_M]  16.2,15.59 0 bottom
OSC  21.39,20.65 180 top
R1  16.08,2.84 270 top
R2  20.12,2.87 270 top
R3  33.5,37.29 90 bottom
R4  34.95,37.29 90 bottom
R5  5.6K  [0603']  24.49,10.31 180 top
R6  10K  [0603']  24.49,8.71 0 top
R7  14.68,16.13 0 bottom
R8  19.89,17.4 270 bottom
R9  36.86,44.58 0 top
R10  40.39,44.53 180 top
R11  36.83,46.15 0 top
R12  40.39,46.15 180 top
R13  55.41,47.43 0 top
R14  52.29,44.62 90 top
R15  54.13,43.49 270 top
R16  3.53,42.85 270 bottom
R17  5.05,42.85 270 bottom
R18  6.55,42.88 270 bottom
R19  8,42.9 270 bottom
R20  9.55,42.9 270 bottom
R21  11.02,42.88 270 bottom
R22  12.47,42.88 270 bottom
R23  13.97,42.85 270 bottom
R24  18.9,47.12 270 top
R25  17.02,47.19 270 top
R26  31.6,28.45 180 top
R27  30.68,30.18 0 top
R28  29.13,36.6 180 bottom
R29  3.15,15.75 0 bottom
R30  6.43,15.75 180 bottom
R31  24.16,21.44 270 bottom
R32  54.61,19.66 270 bottom
R33  54.43,23.22 90 bottom
R34  35.2,15.6 0 bottom
R35  5.08,30.66 90 top
R36  31.78,24.23 90 bottom
R37  100K  [0603']  11.28,21.67 0 top
R38  100K  [0603']  8.05,22.33 0 top
R40  10K  [0603']  2.49,21.62 0 top
U1  23.5,29.24 0 top
U2  18.49,38 90 top
U3  11,29.87 90 top
U4  14.68,18.39 270 top
U5  8.71,20.37 0 top
U6  9.86,36.68 180 top
U7  50.76,39.31 0 top

### Tracks (layer width: path | path; a pad name or v marks a point on that pad's centre or on a via)
1V1  (via drill 0.35)
  Top 0.152: v23.9,23.57 23.5,23.98 U1.23 | v17.58,29.69 17.65,29.69 18,30.04 U1.6 | L2.2 25.13,39.02 C26.2 | U1.50 24.7,34.94 24.26,35.38 24.26,37.08 24.69,37.52 C26.2 | C24.2 29.53,30.3 v28.27,30.3 27.6,29.64 U1.39 | C26.2 24.64,37.52 v23.44,38.71
  Bottom 0.152: C23.2 24.66,22.81 v23.9,23.57 23.39,24.08 23.39,25.6 22.76,26.24 | C22.2 17.58,28.48 v17.58,29.69 19.02,29.69 20.62,28.09 | 20.62,28.09 20.62,26.57 20.95,26.24 22.76,26.24 | v28.27,30.3 27.28,30.3 26.87,29.9 26.87,27.2 25.91,26.24 22.76,26.24 | v23.44,38.71 23.47,38.68 v23.47,37.31 22.35,37.31 21.77,36.73 21.77,33.33 20.62,32.18 20.62,28.09
  pour Top (no thermals): 22.78,37.11 22.78,39.24 23.01,39.47 23.55,40.01 25.07,40.01 25.45,39.62 25.45,39.55 25.45,38.4 25.53,38.33 25.53,37.11 25.45,37.03 24.38,37.03 24.31,36.96 24.31,35.81 23.93,35.81 23.55,36.2 22.94,36.8 22.78,36.96
  pour Bottom (no thermals): 17.25,28.91 17.25,29.87 17.55,30.18 19.56,30.18 20.4,31.01 20.4,32.64 21.44,33.68 21.44,39.65 21.82,40.03 23.47,40.03 24.43,39.07 24.43,36.86 22.15,34.57 22.15,33.02 21.08,31.95 21.08,27.2 21.62,26.67 25.5,26.67 26.29,27.46 26.29,30.43 26.87,31.01 28.55,31.01 28.8,30.76 28.8,30 28.52,29.72 27.43,29.72 27.43,27.1 25.65,25.32 24.49,25.32 24.43,25.27 24.43,24.18 24.94,23.67 24.94,23.11 24.74,22.91 23.72,22.91 22.89,23.75 22.89,24.49 21.74,25.63 20.7,25.63 19.86,26.47 19.86,28.12 18.87,29.11 18.26,29.11 17.96,28.8 17.96,28.57 17.58,28.57
  pour Top (no thermals): 27.66,29.67 27.66,30.45 28.04,30.84 29.26,30.84 29.57,30.53 28.7,29.67
5V2
  Top 0.305: CON1.2 7.01,52.41 7.01,50.34 4.9,48.23 4.04,48.23 0.91,45.11 0.91,29.77 3.64,27.04 C35.2 3.14,26.27 D4.1
ADC-VREF
  Bottom 0.152: R27.2 32.45,29.26 R26.1
CLK
  Top 0.152: U6.13 10.34,33.83 10.34,29.06 9.73,28.45 8.3,28.45 U3.13
CS
  Top 0.152: U6.10 6.71,33.98 | 6.71,33.98 6.85,33.98 | U3.10 6.18,30.52 5.54,31.17 5.54,32.16 6.71,33.33 6.71,33.98
DATA
  Top 0.152: R33.2 60.49,24.07 CN1.3
DIN
  Top 0.152: U3.11 8.79,29.87 9.58,30.66 9.58,32.11 8.91,32.77 8.2,32.77 7.95,33.02 U6.11
DOUT
  Top 0.152: U3.12 9.13,29.22 9.96,30.05 9.96,32.56 9.22,33.3 U6.12
GND  (via drill 0.35)
  Top 0.152: 56.19,36.4 56.2,36.4 v56.8,37 56.9,36.9 57.9,36.9 59.4,38.4 v59.4,43.8 | 56.19,36.4 v48.2,36.4 47.3,36.4 v46.5,37.2 44.8,37.2 41.89,34.29 v41.89,33.58 40.88,32.56 v39.35,32.56 39.1,32.82 v39.1,35.1 | v60.47,39.74 v60.47,42.53 | v50.12,33.23 50.4,33.23 51.26,34.09 52.38,34.09 52.73,33.73 v53.12,33.73 53.12,33.24 v55.19,31.17 | v55.51,35.66 55.51,35.72 56.19,36.4 | OSC.4 22.59,18.94 24.12,17.41 C30.1 | U1.47 25.89,33.6 26.83,34.54 C27.1 C26.1 27.37,38.05 28.27,38.05 29.34,39.12 29.34,39.88 | 13.09,36.44 14.21,37.55 C11.1 16.07,37.88 16.21,37.74 | 13.09,36.44 11.76,35.1 U6.14 11.76,34.79 11.14,35.41 | U4.3 U4.PAD 14.68,18.95 14.71,18.97 14.79,18.89 14.91,18.89 | 14.91,18.89 U4.9 16.39,18.89 16.82,18.46 v17.83,18.46 19.68,18.46 R8.1 19.89,18.03 22.48,18.03 v22.58,17.93 v22.59,17.94 OSC.4 | 14.91,18.89 14.91,19.63 15.58,20.31 C3.1 15.7,20.68 v16.71,21.69 16.83,21.58 C31.1 18.8,21.55 OSC.2 20.49,21.55 | U1.61 U1.P$63 | U1.61 U1.P$68 | U1.61 U1.P$64 | U1.61 U1.P$66 | U1.61 U1.P$67 | U1.61 U1.P$69 | v32.33,33.5 31.98,33.15 C20.1 | C24.1 31.53,29.44 C19.1 32.27,26.66 | 16.21,37.74 16.47,38 U2.9 19.24,37.25 U2.4 19.24,35.62 v19.56,35.31 | OSC.4 22.59,20.02 22.03,20.02 | v31.42,18.87 31.75,19.2 LED1.CATHODE 32.99,21.63 32.99,25.93 32.27,26.66 | BT2.D 27.89,8.98 | 27.89,8.98 35.92,8.98 | 35.92,8.98 BT2.C 36.03,7.38 v35.69,7.04 | CN1.2 62.23,20.5 63.58,19.15 63.58,13.95 60.6,10.97 55.63,10.97 CON3.GND 55.55,10.08 54.61,9.14 54.61,7.62 55.88,6.35 58.5,6.35 v59.64,7.49 | C29.1 16.85,41.35 17.48,41.35 18.22,42.1 C28.1 20.32,42.52 v20.42,42.62 | C15.1 16.95,37 16.21,37.74 | C13.1 12.1,26.42 C12.1 9.08,25.72 8.59,25.22 7.7,25.22 7.2,24.73 C32.1 R38.1 7.2,21.78 v6.35,20.93
  Top 0.152: C16.1 16.07,26.76 15.35,26.05 15.35,25.44 v15.33,25.44 14.53,24.64 13.26,24.64 12.21,25.69 C13.1 | 27.89,8.98 27.74,8.82 v27.74,7.19 25.16,7.19 R6.1 | BT1.A 2.23,8.93 | 2.23,8.93 10.19,8.93 | 10.19,8.93 BT1.B | BT1.B 13.24,6.03 CON2.SHILED5 14.28,6.6 CON2.A1,B12:GND | U6.9 4.25,33.98 v3.83,34.39 | U3.7 13.63,31.62 11.91,31.62 11.13,30.84 11.13,28.34 12.21,27.27 C13.1 | 10.19,8.93 10.19,9.65 v8.41,11.43 8.41,11.38 v6.99,9.96 | 32.27,26.66 v32.26,26.64 | C18.1 28.46,23.28 27.1,24.64 v27.1,24.71 | v33.67,17.17 33.39,16.89 33.39,16.55 32.84,16 32.84,14.96 v33.33,14.48 | v34.92,12.04 35.92,11.05 35.92,8.98 | v28.98,4.75 28.19,3.96 v26.11,3.96 24.92,2.77 23.27,2.77 CON2.SHILED8 21.39,0.89 16.28,0.89 15.32,1.85 CON2.SHILED6 11.66,3.91 v11.66,4.01 11.2,4.01 v9.02,1.83 | U6.9 5.41,34.75 6.07,35.41 11.14,35.41 | U6.9 4.17,32.74 3.53,32.74 3.3,32.51 v3.3,31.04 | CON1.25 37.53,52.55 32.45,52.55 CON1.20 29.96,52.5 24.88,52.5 CON1.14 22.29,52.45 19.75,52.45 CON1.9 17.03,49.73 v14.91,49.73 | v2.21,10.16 2.21,8.95 2.23,8.93 | 29.34,39.88 29.44,39.78 C1.1 30.82,38.44 v31.9,37.36 | 29.34,39.88 v29.29,39.93 | C2.1 35.85,41.09 v35.51,41.43 | CON2.B1,A12:GND 21.78,6.6 CON2.SHILED2 22.35,4.75 v23.29,3.81 | C25.1 31.17,35.15 v31.39,35.38 | C33.1 50.84,16.08 LED2.3-VSS | 11.14,35.41 11.14,36.03 v12.45,37.34 | 13.09,36.44 13.46,36.07 v13.46,35.56 | BT1.B 9.35,7.92 v9.02,7.92 | C34.1 8.64,14.86 v8.26,14.48 | D4.2 2.49,25.36 2.56,25.28 2.56,24.56 2.77,24.36 4.06,24.36 4.25,24.55 | 4.25,24.55 4.9,25.2 4.9,27.33 v3.76,28.47 | 4.25,24.55 4.25,23.86 v3.94,23.55 | v5.64,25.3 5.64,23.55 v5.56,23.47
  Top 0.305: CON2.SHILED6 CON2.SHILED5 | C33.1 53.77,15.32 55.63,13.46 55.63,10.97 | C35.1 1.94,25.51 D4.3 1.86,25.43 2.46,25.43 D4.2
  Bottom 0.152: R15.1 54.15,44.37 C8.1 C9.1 | C9.1 58.67,45.42 v58.67,47.24 58.73,47.24 | v46.5,37.2 46.76,37.46 U7.23 | v48.2,36.4 48.76,36.96 U7.19 | 48.9,36.4 v48.2,36.4 | 48.9,36.4 49.26,36.76 U7.18 | 50,36.4 50.26,36.66 U7.16 | 50,36.4 48.9,36.4 | 50.63,36.4 50.7,36.4 51.26,36.96 U7.14 | 50.63,36.4 50,36.4 | 56.7,37 55.7,37 55.65,37.05 | 56.7,37 v56.8,37 57.26,37.46 U7.2 | 55.1,37 54.9,37 54.76,37.14 U7.7 | 55.1,37 55.6,37 55.65,37.05 | 54.3,36.9 55,36.9 55.1,37 | 54.3,36.9 53.4,36.9 53.26,37.04 U7.10 | C9.1 58.83,44.37 v59.4,43.8 59.4,43.6 v60.47,42.53 | v58.31,40.76 59.45,40.76 v60.47,39.74 61.55,38.66 63.65,38.66 | 58.73,47.24 59.95,47.24 v60.6,46.6 62.12,48.12 v62.12,48.76 v63.32,47.56 63.99,46.89 v63.99,45.06 62.77,43.84 v62.77,42.42 62.77,39.63 v63.74,38.66 63.65,38.66 | C6.1 47.17,43.86 C7.1 46.88,45.43 v47.93,46.48 49.46,46.48 C10.1 50.27,52.51 | U7.21 47.76,36.84 v48.2,36.4 | U7.9 53.76,37.44 53.99,37.21 | 53.99,37.21 54.3,36.9 | U7.8 54.26,37.48 53.99,37.21 | U7.6 55.26,37.44 55.65,37.05 | U7.15 50.76,36.53 50.63,36.4 | v32.33,33.5 31.95,33.88 28.14,33.88 U1.P$70 U1.61 U1.P$65 | C14.1 31.55,31.8 | 31.55,31.8 32.33,32.58 v32.33,33.5 | 23.5,35.43 24.57,36.51 C21.1 25.2,38.76 21.34,42.62 | C22.1 17.3,26.71 16.59,26 15.89,26 v15.33,25.44 15.67,25.44 15.67,25.39 15.34,25.39 15.34,24.38 14.71,23.75 14.71,22.78 15.8,21.69 v16.71,21.69 16.79,21.61 | U1.P$65 U1.P$63 U1.P$68 U1.P$69 | U1.P$65 U1.P$64 U1.P$66 U1.P$67 | v22.58,17.93 24,17.93 27.74,14.2 v27.74,7.19 | v3.83,34.39 9.07,39.62 9.07,45.72 13.08,49.73 v14.91,49.73 | v6.35,20.93 4.52,19.1 4.52,12.7 5.79,11.43 8.26,11.43 | 8.26,11.43 v8.41,11.43
  Bottom 0.152: CN1.2 63.65,22.63 63.65,38.48 | 63.65,38.48 63.65,38.66 | v32.26,26.64 33.63,28.02 33.63,30.3 33.45,30.48 32.31,30.48 32.31,30.71 31.55,31.47 31.55,31.8 | v27.1,24.71 27.1,23.1 C23.1 27.38,22.81 31.32,18.87 v31.42,18.87 32.03,18.87 33.67,17.23 v33.67,17.17 | v33.33,14.48 33.33,13.13 34.42,12.04 v34.92,12.04 | v35.69,7.04 35.66,7.01 | 35.66,7.01 33.4,4.75 v28.98,4.75 30.61,3.12 v30.61,2.97 v33.66,2.97 34.72,2.97 CN6.1 36.91,2.97 v37.72,2.97 38.73,3.99 v38.73,5 | R35.1 4.88,29.81 | 4.88,29.81 4.25,29.81 3.3,30.76 v3.3,31.04 | 16.79,21.61 17.83,20.57 v17.83,18.46 | C17.1 17.42,22.25 16.79,21.61 | CON1.25 38.85,51.47 39.93,52.55 42.71,52.55 CON1.30 44.22,53.77 45.52,52.48 47.72,52.48 CON1.34 50.27,52.51 | 58.73,47.24 58.73,49.13 CON1.39 55.35,52.51 50.27,52.51 | v3.83,34.39 0.61,31.17 0.61,10.82 1.27,10.16 v2.21,10.16 | 21.34,42.62 v20.42,42.62 20.42,36.17 v19.56,35.31 | v29.29,39.93 26.59,42.62 | 26.59,42.62 21.34,42.62 | v35.51,41.43 34.31,42.62 26.59,42.62 | R2.2 22.19,2.02 CON2.SHILED8 CON2.SHILED2 | CON2.SHILED2 24.43,3.96 v26.11,3.96 26.36,3.96 v28.65,1.68 28.4,1.42 v24.59,1.42 | v55.19,31.17 55.22,31.19 56.16,31.19 57.71,32.74 57.71,33.98 56.7,34.99 56.7,37 | v32.33,33.5 32.33,34.44 v31.39,35.38 31.39,36.85 v31.9,37.36 | CON2.SHILED5 13.68,6.03 v11.66,4.01 10.79,4.88 v10.03,4.88 | CON2.SHILED2 23.29,5.1 v23.29,3.81 | CON2.SHILED6 9.04,1.85 v9.02,1.83 8,2.85 v8,3.86 | v1.91,48.56 1.91,46.53 2.88,45.55 | 2.88,45.55 v2.92,45.52 | v2.92,39.42 2.76,39.59 | 2.76,39.59 1.52,40.82 1.52,44.7 2.38,45.55 2.88,45.55 | 2.76,39.59 2.5,39.59 1.27,38.35 1.27,36.83 1.91,36.2 v1.91,35.36 2.87,34.39 v3.83,34.39
  Bottom 0.152: v59.64,7.49 61.42,9.27 61.98,9.27 | 61.98,9.27 v62.18,9.27 63.7,7.75 v63.7,7.49 | 61.98,9.27 61.98,9.73 v59.13,12.57 60.66,14.1 v60.66,14.35 60.15,14.35 v58.62,15.88 | v31.62,7.04 32.64,8.05 v33.66,8.05 34.62,8.05 35.66,7.01 | v61.8,27.86 61.8,32.18 v61.04,32.94 62.18,34.09 v62.18,35.74 62.18,37.01 63.65,38.48 | v8.26,14.48 8.26,11.43 | v3.76,28.47 4.88,29.59 4.88,29.81 | v3.94,23.55 5.56,25.17 5.56,25.3 v5.64,25.3
  Bottom 0.305: R1.2 15.94,1.85 CON2.SHILED6
  pour Bottom (rank 6): -10.2,66.1 88.9,66.1 88.9,-20.7 -10.2,-20.7
  pour Top (rank 6): -10.7,66.3 89.5,66.3 89.5,-21.21 -10.7,-21.21
GP0  (via drill 0.35)
  Top 0.152: U1.2 17.95,31.64 15.52,34.06 v15.39,34.06
  Bottom 0.152: v15.39,34.06 15.39,38.3 12.6,41.1 12.6,41.91 15.7,45.01 17.96,45.01 18.9,45.95 R24.2 25.54,46.27 CN4.1
GP1  (via drill 0.35)
  Top 0.152: U1.3 17.15,31.23 16.13,32.26 v15.93,32.26 | CN5.1 10.29,37.11 v10.36,37.03
  Bottom 0.152: v15.93,32.26 15.93,32.33 14.38,33.88 14.38,37.08 10.67,40.79 | R25.2 16.7,46.34 16.08,45.72 14.07,45.72 10.67,42.32 10.67,40.79 | v10.36,37.03 10.67,37.34 10.67,40.79
GP10  (via drill 0.35)
  Top 0.152: U1.14 19.32,26.84 19.07,26.59 19.07,26.26 17.96,25.15 v17.83,25.15
  Bottom 0.152: v17.83,25.15 17.83,24.66 CN2.1
GP12
  Top 0.152: U1.16 19.54,24.64 CN3.1
GP22  (via drill 0.35)
  Top 0.152: U3.8 6.75,31.82 v6.55,31.62 | U1.34 27.53,27.64 28.19,26.98 v28.19,26.9 | v35.74,17.75 38.96,14.53 38.96,8.79 35.81,5.64 v25.45,5.64
  Bottom 0.152: v6.55,31.62 5.2,31.62 R35.2 4.7,31.89 2.93,31.89 1.29,30.25 1.29,14.07 8.64,6.73 12.34,6.73 13.95,8.33 22.76,8.33 v25.45,5.64 | v28.19,26.9 30.02,25.07 30.02,22.86 35.13,17.75 v35.74,17.75
GP25  (via drill 0.35)
  Top 0.152: U1.37 28.06,28.84 31.77,25.12 R36.2 31.77,26.14 v30.99,26.92 | 56.64,16.45 v56.64,13.97 | v52.32,1.78 40.13,1.78 37.59,4.32 37.59,6.1 39.62,8.13 39.62,15.67 v36.65,18.64
  Bottom 0.152: v56.64,13.97 58.93,11.68 58.93,8.38 v52.32,1.78 | v36.65,18.64 30.99,24.31 v30.99,26.92
GPIO21  (via drill 0.35)
  Top 0.152: LED2.4-DIN 53.34,19.22 53.34,17.68 54.06,16.95 54.88,16.95 v54.94,17.02 | U1.31 27.72,26.43 28.17,25.98 29.31,25.98 29.64,25.65 29.64,22.28 v29.31,21.95 | v35.81,25.43 36.32,24.92 36.32,22.84 36.85,22.3 37.77,22.3 38.38,22.91 38.38,24.89 39.19,25.7 55.7,25.7 v55.91,25.5
  Bottom 0.152: v29.31,21.95 31.47,19.79 32.17,19.79 35.17,16.79 36.12,16.79 37.39,18.06 37.39,19.03 36.8,19.61 36.55,19.61 36.3,19.86 36.3,24.94 v35.81,25.43 | v55.91,25.5 56.79,24.61 56.79,18.54 55.27,17.02 v54.94,17.02
GPIO23  (via drill 0.35)
  Top 0.152: U1.35 27.92,28.04 30.07,25.88 30.07,19.07 27.41,16.41 21.67,16.41 21.53,16.55 R8.2 19.25,16.55 v18.47,17.34 | U4.7 15.95,17.87 16.27,17.87 16.87,17.27 v16.87,16.69
  Bottom 0.152: v18.47,17.34 17.82,16.69 v16.87,16.69
GPIO24  (via drill 0.35)
  Top 0.152: R6.2 R5.1 | R5.1 25.3,10.35 | U1.36 27.98,28.43 30.63,25.78 30.63,18.49 29.93,17.79 v29.93,17.44 | v32.33,12.29 30.35,10.31 R5.1
  Bottom 0.152: v29.93,17.44 32.33,15.04 v32.33,12.29
GPIO29  (via drill 0.35)
  Top 0.152: U1.43 28.85,31.23 29.31,31.7 v32.82,31.7 | v20.14,12.9 20.14,12.95 21.97,14.78 30.23,14.78 35,19.56 v35,23.72 | v8.53,18.14 8.53,18.85 U5.S
  Bottom 0.152: v32.82,31.7 34.01,31.7 34.92,30.79 34.92,23.8 v35,23.72 | v20.14,12.9 11.4,12.9 8.53,15.77 v8.53,18.14
MINUS
  Top 0.152: 17.27,6.62 CON2.B7:DN2 17.28,5.78 17.53,5.54 18.09,5.54 18.28,5.74 CON2.A7:DN1
  Top 0.305: CON2.B7:DN2 17.28,8.32 18.24,9.27 18.24,13.01 21.13,15.9 29.64,15.9 33.76,20.02 33.76,34.04 33.48,34.31 33.48,36.41 R3.1
N$1  (via drill 0.35)
  Top 0.152: CON2.A5:CC1 16.78,5.01 v17.02,4.78
  Bottom 0.152: R1.1 17.02,4.63 v17.02,4.78 17.02,3.99 v17.42,3.58
  pour Top: 16.13,3.43 16.13,4.7 16.64,5.21 17.27,5.21 18.03,4.45 18.03,3.43 17.53,2.92 16.64,2.92
  pour Bottom: 15.75,3.3 15.75,4.32 16.51,5.08 17.27,5.08 18.03,4.32 18.03,3.56 17.91,3.43 17.91,3.17 17.65,2.92 16.13,2.92
  pour Bottom: 18.29,2.54 18.29,3.05 18.67,3.43 18.67,5.08 18.92,5.33 19.81,5.33 20.45,4.7 20.45,3.94 19.05,2.54
N$2  (via drill 0.35)
  Top 0.152: CON2.B5:CC2 19.78,5.46 v19.15,4.83
  Bottom 0.152: R2.1 19.15,4.68 v19.15,4.83 19.15,3.43 v18.75,3.02
  pour Top: 18.29,2.41 18.29,3.05 18.8,3.56 18.8,4.19 18.54,4.45 18.54,5.08 18.67,5.21 18.92,5.46 19.56,5.46 19.68,5.59 19.68,5.97 19.81,5.97 20.07,5.71 20.07,5.21 20.07,3.43 19.94,3.3 18.92,2.29 18.54,2.29 18.41,2.29
N$6
  Top 0.305: D4.5 2.49,22.48 R40.1
N$7
  Bottom 0.152: C4.1 45.61,43.48 45.61,41.29 45.26,40.94 U7.26
N$9
  Top 0.152: U6.1 14.3,41.67 R23.2
N$10
  Top 0.152: L1.1 12.08,17.89 U4.4
N$11
  Top 0.152: U4.2 11.83,18.89 L1.2
N$12
  Top 0.152: R7.1 15.53,16.99 U4.6
N$13
  Top 0.152: U6.2 13.03,40.59 12.47,41.15 R22.2
N$14
  Bottom 0.152: C4.2 44.76,41.92 U7.27
N$16
  Top 0.152: U6.3 11.76,40.16 11.02,40.89 R21.2
N$17
  Top 0.152: U6.4 10.49,40.13 9.55,41.07 R20.2
N$18
  Top 0.152: U6.5 9.22,39.93 8,41.15 R19.2
N$19
  Bottom 0.152: C5.1 44.26,40.8 U7.28
N$20
  Top 0.152: U6.6 7.95,40.13 6.55,41.53 R18.2
N$21
  Bottom 0.152: C5.2 41.98,41.08 42.67,40.39 43.43,40.39 43.76,40.06 U7.29
N$22
  Top 0.152: U6.7 6.68,40.01 5.87,40.82 5.41,40.82 5.05,41.17 R17.2
N$23
  Bottom 0.152: R15.2 54.13,41.38 54.36,41.15 54.86,41.15 55.76,40.25 U7.5
N$24
  Bottom 0.152: C8.2 55.83,41.2 56.26,40.77 56.26,40.76 U7.4
N$25
  Bottom 0.152: C9.2 57.62,41.62 56.76,40.76 U7.3
N$26
  Bottom 0.152: 50.06,40.64 48.44,40.64 48.26,40.46 U7.20 | R14.1 52.9,43.15 52.9,41.4 52.14,40.64 50.06,40.64 | U7.17 49.76,40.34 50.06,40.64
N$27
  Bottom 0.152: D1.ANODE 49.9,45.23 C10.2 52.16,45.59 R14.2 52.29,46.69 53.03,47.43 R13.1
N$28
  Top 0.152: U6.8 4.56,39.38 3.53,40.41 R16.2
N$34  (via drill 0.35)
  Top 0.152: U1.44 27.8,31.64 v28.17,32
  Bottom 0.152: v28.17,32 28.32,32.16 29.45,32.16 C14.2 R27.1
N$39
  Top 0.152: U5.D 9.78,21.02 R37.1 9.77,22.33 R38.2 C32.2
N$41
  Top 0.152: R29.2 2.3,13.58 BT1.C BT1.D
N$44
  Top 0.152: LED1.ANODE 31.75,23.36 R36.1
OSC-IN
  Top 0.152: 18.73,19.88 C31.2 18.9,19.75 OSC.3 20.64,19.75 21.46,20.57 21.46,22.55 22.7,23.79 U1.21
OSC-OUT
  Top 0.152: C30.2 R31.2 23.19,21.55 OSC.1
PIN11
  Top 0.152: R16.1 3.53,45.11 7.21,48.79 20.45,48.79 21.07,49.42 CON1.11
PIN13
  Top 0.152: R17.1 5.23,43.88 5.23,45.64 7.85,48.26 22.4,48.26 23.61,49.47 CON1.13
PIN15
  Top 0.152: R18.1 6.55,45.97 8.26,47.68 25.15,47.68 26.15,48.68 CON1.15
PIN29
  Top 0.152: R19.1 8,46.35 8.66,47.02 30.5,47.02 32.26,48.77 42.72,48.77 43.93,49.98 CON1.29
PIN31
  Top 0.152: R20.1 9.55,45.34 10.59,46.38 31.11,46.38 33.07,48.34 44.68,48.34 46.47,50.13 CON1.31
PIN33
  Top 0.152: R21.1 11.02,44.81 11.99,45.77 31.62,45.77 33.58,47.73 46.91,47.73 49.01,49.82 CON1.33
PIN35
  Top 0.152: R22.1 12.47,44.63 13.06,45.21 32.08,45.21 34.04,47.17 50.29,47.17 51.55,48.43 CON1.35
PIN37
  Top 0.152: R23.1 49.77,43.7 54.09,48.02 CON1.37
PLUS
  Top 0.305: CON2.B6:DP2 18.78,8.88 | 18.78,8.88 18.78,12.76 21.41,15.39 29.78,15.39 34.27,19.88 34.27,34.39 34.95,35.08 R4.1 | CON2.A6:DP1 17.78,7.88 18.78,8.88
QSPI-CLK
  Top 0.152: U1.56 22.3,34.14 20.24,36.2 20.24,39.88 19.76,40.36 18.9,40.36 18.74,40.2 U2.6
QSPI-SD0
  Top 0.152: U1.57 21.89,33.96 19.84,36.02 19.84,38.8 U2.5
QSPI-SD1
  Top 0.152: U2.2 18.24,35.05 19.25,34.04 20.62,34.04 21.09,33.57 U1.59
QSPI-SD2
  Top 0.152: U1.58 21.5,33.75 20.68,34.57 19.2,34.57 18.74,35.03 U2.3
QSPI-SD3
  Top 0.152: 22.71,32.69 U1.55 22.7,34.35 20.7,36.35 20.7,40.41 20.34,40.77 18.64,40.77 18.24,40.37 U2.7
QSPI-SS  (via drill 0.35)
  Top 0.152: U2.1 17.74,35.04 v19.84,32.94 20.11,32.67 U1.60 | R29.1 4.09,15.75 | 4.09,15.75 R30.1 | 2.52,17.32 2.59,17.25 | 2.59,17.25 4.09,15.75 | 2.59,17.25 2.59,17.7 v2.85,17.96
  Bottom 0.152: v19.84,32.94 16.64,29.74 16.64,27.91 15.62,26.9 14.58,26.9 13.05,25.36 13.05,23.77 11.4,22.12 9.55,22.12 9.09,22.58 5.92,22.58 4.9,21.57 4.9,20.24 2.85,18.19 v2.85,17.96
RUN  (via drill 0.35)
  Top 0.152: R34.1 36.05,13.5 BT2.A v31.11,13.48 BT2.B | U1.26 24.7,24.91 26.52,23.09 26.52,20.78 27.18,20.12 v27.18,19.63
  Bottom 0.152: v27.18,19.63 27.18,19.07 31.11,15.14 v31.11,13.48
SCL  (via drill 0.35)
  Top 0.152: U1.28 25.5,25.23 27.66,23.07 27.66,21.44 v29.16,19.94
  Bottom 0.152: U7.13 51.7,39.02 51.7,32.3 50.92,31.52 39.65,31.52 36.78,28.65 | v29.16,19.94 32.87,16.23 36.8,16.23 37.85,17.27 37.85,19.23 36.75,20.32 36.75,24 | 36.75,24 37.21,24.46 48.01,24.46 49.55,22.92 CON3.SCL | 36.75,24 36.75,28.63 36.78,28.65 | 36.78,28.65 36.78,35.94 40.28,39.45 40.28,42.55 | R12.1 R10.1 41.24,43.5 40.28,42.55 | 40.28,42.55 40.26,42.55
SCL-PASPI  (via drill 0.35)
  Top 0.152: CON1.5 14.71,52.49 14.71,54.79 15.27,55.35 39.6,55.35 40.16,54.79 v40.16,49.73
  Bottom 0.152: v40.16,49.73 40.16,48.31 39.54,47.69 R12.2
SDA  (via drill 0.35)
  Top 0.152: U1.27 25.09,24.95 26.82,23.21 26.82,21.46 28.25,20.04 28.25,19.07 v28.5,18.82 | v37.52,23.29 37.52,27.2 v37.64,27.33 37.64,35.97 40.11,38.43 40.11,39.93 v37.85,42.19
  Bottom 0.152: 52.26,37.38 U7.12 | U7.11 52.76,37.88 52.26,37.38 | 51.95,11.37 CON3.SDA 51.55,7.45 50.52,6.43 47.19,6.43 46.42,7.2 46.42,13.7 47.68,14.96 47.68,22.91 46.81,23.77 38,23.77 v37.52,23.29 | 52.26,37.38 52.25,37.37 52.25,35.75 54.8,33.2 v55.1,33.2 52.54,30.64 40.95,30.64 v37.64,27.33 | v28.5,18.82 29.34,18.82 32.56,15.6 37.44,15.6 38.35,16.51 38.35,19.51 37.26,20.6 37.26,23.04 v37.52,23.29 | v37.52,23.29 37.47,23.24 | v37.85,42.19 36.01,44.03 36.01,44.5 | 36.01,44.5 R9.1 | R11.1 35.98,44.53 36.01,44.5
SDA-RASPI
  Bottom 0.152: CON1.3 12.14,52.46 12.14,55.07 12.75,55.68 36.47,55.68 37.68,54.47 R11.2
SPI-RX
  Top 0.152: U1.7 18.54,29.64 17.78,28.88 17.25,28.88 16.78,29.35 13.95,29.35 U3.3
SPI-SCLK  (via drill 0.35)
  Top 0.152: U3.2 12.43,28.57 12.17,28.83 v12.17,29.08 | U1.4 20.03,30.86 15.98,30.86 v15.85,30.73
  Bottom 0.152: v12.17,29.08 12.14,29.11 13.77,30.73 v15.85,30.73
SPI_CS  (via drill 0.35)
  Top 0.152: U3.5 12.41,30.52 v12.29,30.4 | v15.27,28.65 15.52,28.4 18.67,28.4 19.51,29.23 U1.8
  Bottom 0.152: v12.29,30.4 11.05,29.16 11.05,28.35 11.68,27.71 14.33,27.71 v15.27,28.65
SPI_TX
  Top 0.152: U3.4 16.31,29.87 16.87,30.43 U1.5
SW_CLK
  Top 0.152: CN1.1 55.46,17.96 R32.2
SWCLK  (via drill 0.35)
  Top 0.152: U1.24 23.89,24.59 25.58,22.91 25.58,18.01 v25.73,17.86 | v39.7,22.25 39.73,22.28 39.73,23.77 40.49,24.54 50.44,24.54 54.47,20.51 R32.1
  Bottom 0.152: v25.73,17.86 29.18,14.4 29.18,12.6 31.42,10.36 36.09,10.36 39.65,13.92 39.65,22.2 v39.7,22.25
SWD  (via drill 0.35)
  Top 0.152: U1.25 24.3,24.73 26.04,22.99 26.04,19 v27.33,17.7 | v38.48,20.55 38.96,21.03 38.96,24.21 39.93,25.17 50.67,25.17 53.48,22.37 R33.1
  Bottom 0.152: v27.33,17.7 29.87,15.16 29.87,12.8 31.52,11.15 35.33,11.15 38.99,14.81 38.99,20.04 v38.48,20.55
UNDER
  Bottom 0.152: R25.1 17.02,50.06 17.3,50.34 17.3,52.07 15.99,53.38 CON1.8
UPWARD
  Bottom 0.152: R24.1 18.9,49.07 19.81,49.99 19.81,52.49 CON1.10
USB_DM
  Top 0.152: U1.51 24.3,34.78 22.2,36.88 22.2,40.59 23.47,41.86 31.6,41.86 32.92,40.54 32.92,39.38 | 32.92,39.38 32.92,38.82 33.5,38.24 R3.2 | C1.2 32.92,39.38
USB_DP
  Top 0.152: U1.52 23.89,34.5 21.89,36.5 21.89,40.77 23.37,42.24 31.83,42.24 33.78,40.28 33.78,39.41 C2.2 34.23,39.78 34.87,39.13 34.87,38.21 R4.2
VBUS  (via drill 0.35)
  Top 0.152: v14.2,11.86 v12.6,11.86 | v22.33,13.16 22.33,11.99 v22.12,11.79 21.94,11.97 20.99,11.01 | CON2.B4,A9:VBUS 20.43,10.46 20.99,11.01 | v21.36,10.52 20.99,10.89 20.99,11.01 | CON2.A4,B9:VBUS 15.59,6.65 15.59,7.3 14.46,8.43 F1.1 13.33,9.45 v12.52,10.26
  Bottom 0.152: v12.52,10.26 12.6,10.34 v12.6,11.86 12.52,11.86 v11.68,11.02 | v23.82,13.13 23.8,13.16 v22.33,13.16 | v14.2,11.86 14.21,11.85 | 14.21,11.85 14.63,11.43 21.51,11.43 21.87,11.79 v22.12,11.79 | v13.46,10.97 13.46,11.1 14.21,11.85
  pour Bottom (no thermals): 11.02,10.34 11.02,11.71 11.73,12.42 15.09,12.42 15.62,11.89 20.65,11.89 21.39,12.62 21.39,14.38 21.67,14.66 23.7,14.66 25.58,12.78 25.58,11.13 24.43,9.98 22.17,9.98 21.84,9.65 14.3,9.65 13.61,8.97 12.4,8.97
  pour Top: 20.32,6.86 20.32,11.68 21.59,12.95 21.59,13.72 22.1,14.22 23.77,14.22 24.92,13.08 22.4,10.57 22.4,10.16 22.35,10.16 20.57,8.38 20.57,6.86
  pour Top (no thermals): 15.42,7.11 15.42,7.26 14.88,7.8 14.35,7.8 14.05,7.49 12.85,7.49 11.79,8.56 11.79,9.75 11.23,10.31 11.15,10.31 11.02,10.44 11.02,11.84 12.24,13.06 14.43,13.06 15.19,12.29 15.19,10.85 14.86,10.52 14.86,8.76 15.29,8.33 15.29,7.85 15.6,7.54 15.6,7.04 15.54,6.99
VBUS-2  (via drill 0.35)
  Top 0.152: D2.2 17.73,11.58 17.73,13.34 18.47,14.07 v18.47,15.82 | v26.16,13.97 26.16,12.84 R5.2
  Top 1.016: F1.2 D2.2
  Bottom 0.152: v18.47,15.82 19.28,16.64 24.36,16.64 26.16,14.83 v26.16,13.97
VRGE_AVDD
  Top 0.152: U1.46 26.3,33.38 28.07,35.15 C25.2 R28.1
VRGE_LV
  Top 0.152: L2.1 26,38.34 26,34.38 25.5,33.87 U1.48
VSYS  (via drill 0.35)
  Top 0.152: C11.2 14.85,35.85 14.3,35.31 U6.16 14.3,33.15 13.78,32.63 12.48,32.63 | v6.53,27.74 v6.53,28.68 5.16,30.05 2.64,30.05 2.3,29.7 v2.29,29.72 | C12.2 6.53,27.27 v6.53,27.74 | v6.53,27.74 7.99,27.74 U3.14 10.31,27.92 v10.57,27.66 | U6.15 13.03,33.17 12.48,32.63 | v11.25,32.16 11.72,32.63 12.48,32.63 | 13.83,16.1 R7.2 13.43,16.53 U4.5 | R37.2 11.89,21.91 v11.89,23.85 | U4.8 16.33,18.39 17.73,16.99 17.73,14.23 16.59,13.08 D2.1 | C33.2 49.14,18.92 LED2.1-VDD
  Top 0.305: 13.48,15.75 13.83,16.1 13.83,15.58 v14.84,14.58 | D2.1 16.26,13.16 v16.26,14.22 | C33.2 49.14,14.36 50.29,13.21 52.58,13.21 53.55,12.24 CON3.VCC | v13.46,14.48 13.08,14.86 C34.2 11.9,15.11 11.9,15.91 11.68,16.13 9.02,16.13 3.63,21.51 | D4.6 3.14,21.82 R40.2 3.53,21.61 3.63,21.51 | v2.87,19.41 2.87,20.75 3.63,21.51
  Bottom 0.152: v11.25,32.16 9.12,30.02 7.34,30.02 6.53,29.21 v6.53,28.68 | v6.53,27.74 8,27.74 v11.89,23.85 11.89,24.54 10.57,25.86 v10.57,27.66 | v2.29,29.72 1.98,29.42 1.98,20.29 v2.87,19.41
  Bottom 0.305: v13.46,14.48 13.56,14.58 v14.84,14.58 15.9,14.58 v16.26,14.22 19.81,14.22 20.83,15.24 23.77,15.24 26.67,12.34 26.67,5.84 31.24,1.27 49.02,1.27 53.55,5.79 CON3.VCC
  pour Top (no thermals): 11.68,16.13 11.81,16.26 12.95,16.26 13.21,16.51 14.22,16.51 14.22,15.75 14.73,15.24 15.49,15.24 15.75,14.99 16.76,14.99 17.78,13.97 17.27,13.46 17.27,12.7 17.02,12.45 16,12.45 14.99,13.46 14.73,13.46 14.63,13.56 12.34,13.56 11.68,14.22
  pour Bottom (no thermals): 10.67,14.99 10.67,16.26 11.18,16.76 13.46,16.76 13.97,16.26 16,16.26 17.02,15.24 17.53,15.24 18.03,14.73 18.29,14.48 18.29,14.22 17.53,13.46 16.26,13.46 12.19,13.46
VSYS_3V3  (via drill 0.35)
  Top 0.152: C18.2 27.86,25.8 U1.30 26.22,25.87 26.22,26.32 26.16,26.38 26.16,29.03 26.39,29.26 | C19.2 30.32,28.96 v29.01,28.96 28.73,29.23 U1.38 26.91,29.26 26.39,29.26 | v21.57,23.9 22.3,24.63 U1.20 22.3,26.35 21.87,26.77 21.18,26.77 21.03,26.92 21.03,27.67 20.67,28.04 | C16.2 17.82,26.88 | 17.82,26.88 18.08,27.13 18.08,26.93 | 18.08,26.93 17.75,26.6 17.75,26.54 15.82,24.61 | C27.2 25.09,36.08 U1.49 25.09,32 | 23.09,34.61 U1.54 23.09,32.14 | 21.11,40.49 20.3,41.3 18.26,41.3 17.68,40.72 17.68,39.46 17.7,39.44 | 17.7,39.44 U2.8 | 23.09,34.61 21.11,36.6 21.11,40.49 | 23.09,34.61 23.5,34.21 U1.53 23.5,32.03 | U4.1 13.43,20.23 C3.2 | C3.2 v13.88,22.05 13.88,22.67 15.82,24.61 | 18.08,26.93 18.08,26.75 19.36,28.04 U1.11 20.67,28.04 | v21.57,23.9 21.51,23.85 | v29.97,38.15 29.98,38.14 R28.2 31.27,36.6 32.31,35.56 32.31,34.82 31.65,34.16 30.1,34.16 29.32,33.39 C20.2 27.74,33.15 26.93,32.34 U1.45 26.5,32.03 26.48,32.01 26.22,32.01 26.01,31.8 | C3.2 13.58,20.37 8.66,20.37 U5.G 7.25,19.73 v7.16,19.63 | R34.2 34.81,16.05 34.81,18.05 35.81,19.05 35.81,24.08 34.92,24.97 34.92,33.68 35.81,34.57 35.81,35.33 37.01,36.52 37.01,40.36 37.08,40.36 | 35.89,42.6 23.01,42.6 21.11,40.69 21.11,40.49 | 17.7,39.44 16.64,39.44 C29.2 15.84,39.28 15.29,39.83 15.29,41.96 15.85,42.52 C28.2 | C15.2 19.32,32.03 U1.1 20.46,32.03 20.54,31.96 20.57,31.96 20.71,31.83 | R30.2 7.28,16.47 6.5,17.25 v5.69,17.25 | U4.10 16.65,19.39 v16.79,19.53 | 15.82,24.61 17.25,24.61 18.52,23.34 21.01,23.34 v21.57,23.9 | v37.82,39.22 37.8,39.24 v37.8,40.36 37.08,40.36 | 35.89,42.6 36.83,42.6 37.44,43.2 38.48,43.2 38.81,42.88 53.03,42.88 55.73,45.57 v55.73,45.87
  Top 0.152: 48.72,34.7 v47.5,34.7 46.64,35.56 v46.18,35.56 | 48.72,34.7 58.9,34.7 61.7,37.5 61.7,43.9 59.4,46.2 v57.3,46.2 | v49.18,35.16 48.72,34.7 | 37.08,40.36 36.83,40.62 36.83,41.66 35.89,42.6 | U3.1 13.82,26.4 C13.2 15.53,27.94 17.02,27.94 17.82,27.13 17.82,26.88 | 26.39,29.26 26.01,29.64 26.01,31.8 | 26.01,31.8 25.93,31.88 25.22,31.88 25.09,32 | 25.09,32 24.84,32 24.61,31.77 23.75,31.77 23.5,32.03 | 23.09,32.14 22.78,31.83 20.71,31.83 | 23.09,32.14 23.2,32.03 23.5,32.03 | 20.71,31.83 20.85,31.69 20.85,31.35 20.85,31.34 20.85,28.22 20.67,28.04
  Bottom 0.152: v29.01,28.96 29.52,28.45 R26.2 | 24.96,35.05 C21.2 26.63,34.81 v29.97,38.15 | v5.69,17.25 5.54,17.4 5.54,18.72 6.45,19.63 v7.16,19.63 | v16.79,19.53 14.28,22.05 v13.88,22.05 | C17.2 21.57,23.18 v21.57,23.9 | R9.2 39.48,44.58 R10.2 39.54,41.64 38.25,40.36 v37.8,40.36 | v55.73,45.87 56.26,46.4 56.26,47.24 | 57.3,46.39 v57.3,46.2 56.26,47.24 | C7.2 48.2,42.46 D1.CATHODE | D1.CATHODE 47.26,40.76 U7.22 47.26,36.54 47.3,36.5 46.9,36.1 46.9,35.3 v47.5,34.7 46.1,34.7 45.1,35.7 45.1,37.1 45.76,37.76 U7.25 | D1.CATHODE 48.66,42.16 C6.2 | 56.26,47.24 R13.2
  pour Bottom (no thermals): 45.52,35.1 45.11,35.51 45.11,35.56 45.11,35.71 45.52,36.12 45.57,36.17 46.79,36.17 47.04,36.17 47.65,35.56 48.67,35.56 48.92,35.81 49.63,35.81 49.73,35.71 49.99,35.46 49.99,34.7 49.33,34.04 46.89,34.04 46.58,34.04
  pour Top (no thermals): 45.26,35.05 45.26,35.81 45.67,36.22 46.79,36.22 47.04,35.97 47.45,35.56 48.26,35.56 48.51,35.56 48.82,35.86 49.99,35.86 50.29,35.56 50.95,34.9 50.95,34.7 50.6,34.34 49.94,34.34 49.43,33.83 46.74,33.83 46.48,33.83
  pour Top: 36.83,38.61 36.83,40.64 36.58,40.89 36.83,41.15 37.08,41.15 38.1,41.15 39.12,40.13 39.12,39.12 38.86,38.86 38.35,38.35 37.08,38.35
  pour Bottom: 37.08,38.86 37.08,40.64 37.34,40.89 37.59,41.15 38.1,41.15 38.35,41.15 38.86,40.64 38.86,39.12 38.1,38.35 37.85,38.35 37.59,38.35
  pour Top (no thermals): 22.28,26.06 22.28,26.19 21.87,26.59 21.11,26.59 20.85,26.85 20.85,31.78 21.03,31.95 22.78,31.95 23.11,32.28 23.44,32.28 23.88,31.85 24.59,31.85 24.79,32.05 24.92,32.05 25.04,32.18 25.17,32.18 25.4,31.95 26.04,31.95 26.21,31.78 26.21,29.49 26.29,29.41 26.29,26.31 26.26,26.29 26.24,26.29 25.73,26.8 25.73,31.19 25.35,31.57 21.56,31.57 21.23,31.24 21.23,27.1 21.41,26.92 21.84,26.92 22.35,26.42 22.35,26.14
  pour Top (no thermals): 13.41,20.98 13.23,21.16 13.23,22.86 14.66,24.28 15.01,24.28 18.87,28.14 19.13,28.14 19.33,27.94 19.33,27.41 17.07,25.15 17.07,24.89 18.47,23.5 20.47,23.5 20.78,23.8 20.78,24.13 21.59,24.94 21.74,24.94 21.77,24.97 22.28,24.97 22.33,24.92 22.33,23.9 21.08,22.66 18.06,22.66 18.06,23.14 16.89,24.31 16.05,24.31 14.58,22.83 14.58,21.31 14.25,20.98
XOUT
  Top 0.152: R31.1 23.7,22.29 23.09,22.9 23.09,25.79 U1.22

### Text on the board
tPlace: GP0 | Rev1.0.1 | DKFA-JIG-01 | GP1 | DATA | SWD | GND | BOOT | RESET | CLK | SCL | SDA | VSYS | GND | AI Car Board / TEST | GND | I2C1
bPlace: CON1 | 1 | Not for sale | CON2 | S/N
Document: Testing Jig For AI Car Board / Rev1.0.1 2025/06/05 / DKFA-JIG-01
tDocu: OLED
_tNames: W25Q32 | MCP3008 | 0.96inch OLED | TXB0104PW | RP2350A | RT6150 | TS-06104 | TS-06104 | JST PA 4PIN | 5077CR-16-SMC2-BK-TR